# Altium project pUFM_Digital_Interface_R0.1.PrjPcb (part 1 of 2)
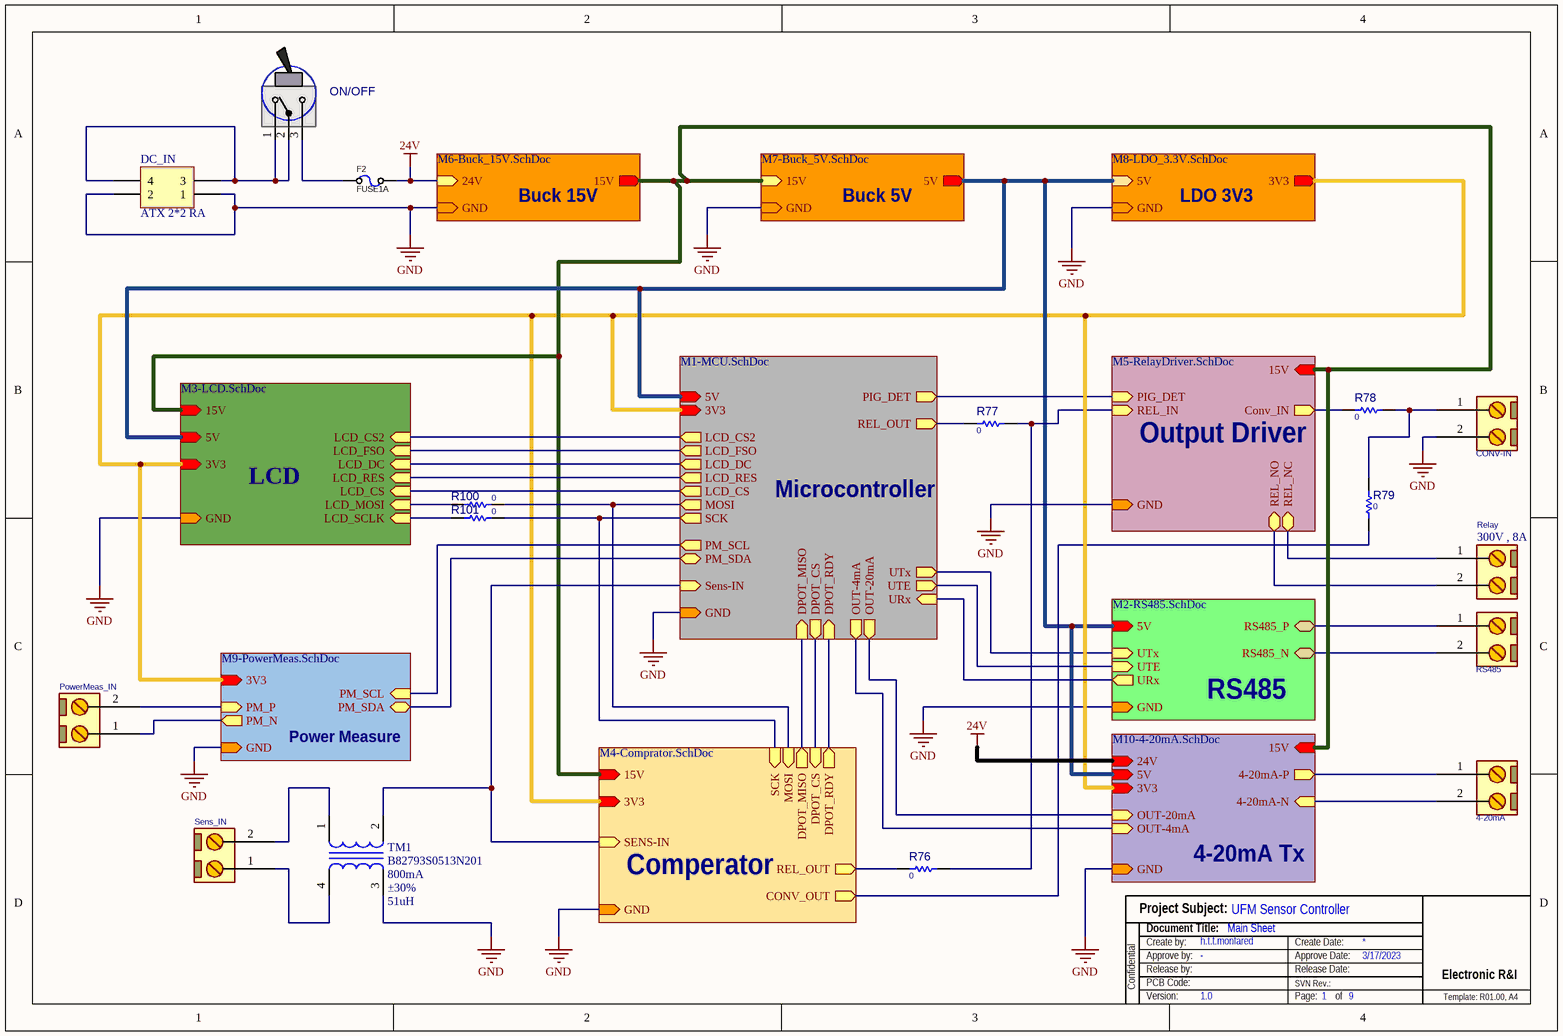
[diagram p0: MainSheet.SchDoc]
Approve Date: 3/17/2023; Approver: Approver; Business Unit: BU name; Config: Config Code; Create Date: TBD; Creator: h.t.t.monfared; Crouse Reference Code: CR Code; Customer Reference: TECH NO; Multi PCBA Code: Multi PCBA Code; PCB Code: 1.00; PCB Name: PCB Name; Product Name: Smart Water Pump Control; Product Version: PR number; Project Code: Project Code; Release Date: -; Responsible: h.t.t.monfared; Semi-finished PCBA Code: Semi-finished PCBA Code; Single PCBA Code: Single PCBA Code; Software: Software Code; Status: Status
11 sheets, 267 parts. Net scope: hierarchical (ports join the sheet entries above them; power ports are global).
Board file: pUFM_Digital_Interface_R0.1-PCB.PcbDoc
Sheets:
  MainSheet.SchDoc
    Microcontroller = M1-MCU.SchDoc
    Buck 15V = M6-Buck_15V.SchDoc
    Buck 5V = M7-Buck_5V.SchDoc
    LDO 3V3 = M8-LDO_3.3V.SchDoc
    Output Driver = M5-RelayDriver.SchDoc
    LCD = M3-LCD.SchDoc
    RS485 = M2-RS485.SchDoc
    Comperator = M4-Comprator.SchDoc
    Power Measure = M9-PowerMeas.SchDoc
    4-20mA Tx = M10-4-20mA.SchDoc

## Sheet MainSheet.SchDoc
size A4; Date: -; ApprovedBy: -; CheckedBy: h.t.t.monfared; Author: h.t.t.monfared; CompanyName: -; Engineer: h.t.t.monfared; Organization: -; Revision: 1.0; SheetNumber: 1; SheetTotal: 9; Project Code:: UFM Sensor Controller; Document Title:: Main Sheet; Material Code: 1.00; ReleasedBy: h.t.t.monfared; ImagePath: -

### Parts
4-20mA  Output  [MSTB_2]  (value not drawn)
CONV-IN  Output  [MSTB_2]  (value not drawn)
DC_IN  ATX 2*2 RA  [POWER_2X2-RA]
F2  FUSE1A  [F2410]
ON/OFF  ToggleSwitch  [SWTOG_SPDT_R_M2012]  (value not drawn)
PowerMeas_IN  (no value)  [MSTB_2]
R76  0  [R1206]
R77  0  [R1206]
R78  0  [R1206]
R79  0  [R1206]
R100  0  [R1206]
R101  0  [R1206]
Relay  300V , 8A  [MSTB_2]
RS485  Output  [MSTB_2]  (value not drawn)
Sens_IN  (no value)  [MSTB_2]
TM1  B82793S0513N201  value 51uH  Current-Rated: 800mA  Tolerance: ±30%  [Choke-7.1_6.0_4.8]

### Sub-sheets
4-20mA Tx = M10-4-20mA.SchDoc: 4-20mA-N (in), 4-20mA-P (out), 3V3 (in), GND (in), OUT-20mA (in), OUT-4mA (in), 15V (in), 24V (in), 5V (in)
Buck 5V = M7-Buck_5V.SchDoc: 15V (in), GND (in), 5V (out)
Buck 15V = M6-Buck_15V.SchDoc: 24V (in), GND (in), 15V (out)
Comperator = M4-Comprator.SchDoc: 15V (in), SENS-IN (in), GND (in), CONV_OUT (out), 3V3 (in), DPOT_CS (in), DPOT_MISO (out), DPOT_RDY (out), REL_OUT (out), SCK (in), MOSI (in)
LCD = M3-LCD.SchDoc: 3V3 (in), GND (in), LCD_MOSI (in), LCD_SCLK (in), 15V (in), 5V (in), LCD_CS (in), LCD_FSO (in), LCD_DC (in), LCD_RES (in), LCD_CS2 (in)
LDO 3V3 = M8-LDO_3.3V.SchDoc: 5V (in), GND (in), 3V3 (out)
Microcontroller = M1-MCU.SchDoc: 3V3 (in), GND (in), Sens-IN (in), UTE (out), UTx (out), URx (in), PIG_DET (out), REL_OUT (out), DPOT_CS (out), DPOT_RDY (in), PM_SDA (bidir), PM_SCL (out), 5V (in), LCD_RES (out), MOSI (out), LCD_CS2 (out), LCD_FSO (out), LCD_DC (out), LCD_CS (out), SCK (out), DPOT_MISO (in), OUT-20mA (out), OUT-4mA (out)
Output Driver = M5-RelayDriver.SchDoc: 15V (in), PIG_DET (in), GND (in), Conv_IN (out), REL_NO (bidir), REL_NC (bidir), REL_IN (in)
Power Measure = M9-PowerMeas.SchDoc: PM_SDA (bidir), 3V3 (in), GND (in), PM_P (in), PM_N (out), PM_SCL (in)
RS485 = M2-RS485.SchDoc: 5V (in), GND (in), RS485_P (bidir), RS485_N (bidir), URx (out), UTx (in), UTE (in)

### Nets
3V3: sheet Microcontroller/3V3, sheet LDO 3V3/3V3, sheet LCD/3V3, sheet Comperator/3V3, sheet Power Measure/3V3, sheet 4-20mA Tx/3V3
5V: sheet Microcontroller/5V, sheet Buck 5V/5V, sheet LDO 3V3/5V, sheet LCD/5V, sheet RS485/5V, sheet 4-20mA Tx/5V
15V: sheet Buck 15V/15V, sheet Buck 5V/15V, sheet Output Driver/15V, sheet LCD/15V, sheet Comperator/15V, sheet 4-20mA Tx/15V
24V: F2.2 ; sheet Buck 15V/24V, sheet 4-20mA Tx/24V
GND: CONV-IN.2 DC_IN.1 DC_IN.2 TM1.3 ; sheet Microcontroller/GND, sheet Buck 15V/GND, sheet Buck 5V/GND, sheet LDO 3V3/GND, sheet Output Driver/GND, sheet LCD/GND, sheet RS485/GND, sheet Comperator/GND, sheet Power Measure/GND, sheet 4-20mA Tx/GND
DPOT_CS: sheet Microcontroller/DPOT_CS, sheet Comperator/DPOT_CS
DPOT_MISO: sheet Microcontroller/DPOT_MISO, sheet Comperator/DPOT_MISO
DPOT_RDY: sheet Microcontroller/DPOT_RDY, sheet Comperator/DPOT_RDY
LCD_CS: sheet Microcontroller/LCD_CS, sheet LCD/LCD_CS
LCD_CS2: sheet Microcontroller/LCD_CS2, sheet LCD/LCD_CS2
LCD_DC: sheet Microcontroller/LCD_DC, sheet LCD/LCD_DC
LCD_FSO: sheet Microcontroller/LCD_FSO, sheet LCD/LCD_FSO
LCD_MOSI: R100.1 ; sheet LCD/LCD_MOSI
LCD_RES: sheet Microcontroller/LCD_RES, sheet LCD/LCD_RES
LCD_SCLK: R101.1 ; sheet LCD/LCD_SCLK
MOSI: R100.2 ; sheet Microcontroller/MOSI, sheet Comperator/MOSI
OUT-4mA: sheet Microcontroller/OUT-4mA, sheet 4-20mA Tx/OUT-4mA
OUT-20mA: sheet Microcontroller/OUT-20mA, sheet 4-20mA Tx/OUT-20mA
PIG_DET: sheet Microcontroller/PIG_DET, sheet Output Driver/PIG_DET
PM_SCL: sheet Microcontroller/PM_SCL, sheet Power Measure/PM_SCL
PM_SDA: sheet Microcontroller/PM_SDA, sheet Power Measure/PM_SDA
REL_OUT: R77.1 ; sheet Microcontroller/REL_OUT
SCK: R101.2 ; sheet Microcontroller/SCK, sheet Comperator/SCK
URx: sheet Microcontroller/URx, sheet RS485/URx
UTE: sheet Microcontroller/UTE, sheet RS485/UTE
UTx: sheet Microcontroller/UTx, sheet RS485/UTx
Net4-20mA_1: 4-20mA.1 ; sheet 4-20mA Tx/4-20mA-P
Net4-20mA_2: 4-20mA.2 ; sheet 4-20mA Tx/4-20mA-N
NetC43_2: RS485.2 ; sheet RS485/RS485_N
NetC44_1: RS485.1 ; sheet RS485/RS485_P
NetCONV-IN_1: CONV-IN.1 R78.2 R79.2
NetD15_2: R78.1 ; sheet Output Driver/Conv_IN
NetDC_IN_3: DC_IN.3 DC_IN.4 ON/OFF.1(T1) ON/OFF.2(COM)
NetF2_1: F2.1 ON/OFF.3(T2)
NetK1_3: Relay.1 ; sheet Output Driver/REL_NC
NetK1_4: Relay.2 ; sheet Output Driver/REL_NO
NetPowerMeas_IN_1: PowerMeas_IN.1 ; sheet Power Measure/PM_N
NetPowerMeas_IN_2: PowerMeas_IN.2 ; sheet Power Measure/PM_P
NetR9_1: TM1.2 ; sheet Microcontroller/Sens-IN, sheet Comperator/SENS-IN
NetR41_1: R76.2 R77.2 ; sheet Output Driver/REL_IN
NetR69_2: R79.1 ; sheet Comperator/CONV_OUT
NetR70_1: R76.1 ; sheet Comperator/REL_OUT
NetSens_IN_1: Sens_IN.1 TM1.4
NetSens_IN_2: Sens_IN.2 TM1.1

### Notes on the sheet
- Project Subject:
- Confidential
- Release by:
- Document Title:
- Create by:
- PCB Code:
- Approve by:
- SVN Rev.:
- Create Date:
- Release Date:
- Approve Date:
- Electronic R&I
- Version:
- Page:
- of
- Template: R01.00, A4

### Library data of the parts
4-20mA CONV-IN PowerMeas_IN Relay RS485 Sens_IN = CONN_MSTB_2: CONN, PHOENIX MSTB, 5-G, 5.08mm pitch; PARAM2: 320V; PARAM: 12A
  4-20mA CONV-IN RS485: VALUE: Output
  Relay: VALUE: 300V , 8A
DC_IN = Header 2X2: Header, 2-Pin, Dual row; LatestRevisionDate: 17-Jul-2002; LatestRevisionNote: Re-released for DXP Platform.; Publisher: Altium Limited
F2 = FUSE_1A_2410: Fuse, 1A, 125VDC, 2410, SMD, Fast Acting; PARAM: 1A; 125VDC; fast acting; MANF: Reomax; MANF_P#: SFE1100; PARAM2: 0.25 Ohm DC Cold Resistance; PRICE: 260toman@Javan; VALUE: FUSE1A
ON/OFF = SWTOG_SPDT_R_M2012: SWITCH, TOGGLE, SPDT, THD; MANF_PART#: M2012SA2W30; MANF: NKK; PARAM: 3A, 125VAC/30VDC; DESC: DESCRIPTION; VALUE: ToggleSwitch; ASSEMBLY: ASSEMBLY; PRICE: 3.5$
R76-R79 R100 R101 = RES_SMD: RESISTOR, SMD; PARAM: -W; DESC: DESCRIPTION; DIST#: MOUSER; PARAM2: 1%; MANF_P#: -; MANF: -; ASSEMBLY: ASSEMBLY; PRICE: 100= 0.5$; VALUE: 0
TM1 = ME90902601: Inductor,S,Choke,Ferrite,800mA,30%,7.1x6x4.8mm; Manufacturer Code1: 0000101476; Manufacturer Name1: TDK Europe GmbH; Unit Price (USD): Coming Soon; Alternative: Please Add; Description Farsi: سلف،S،Choke،800mA،30%،7.1x6x4.8mm; Resistance-DC (Rdc): 0.14(Ohm); Automotive Qualified: AEC-Q200; Frequency-Test-Q: NA; Packing: TAPE AND REEL; Frequency-Test-L: 100KHz; Voltage-Rated: 80V; Material: ME90902601; Function in Circuit: Please Add; Material Class: Inductor; Type: Choke; Lead Free: YES; Frequency-Self Resonant (SRF): NA; ComponentLink1URL: \\192.168.5.63\eRI_ComponentDatabase\Datasheets\SAP\DSH_2025891_00_1.PDF; Termination Style (SMD/THT): SMD; Manufacturer PN1: B82793S0513N201; Quality Factor (Q): NA; ComponentLink1Description: DSH2025891RE: Datasheet-TDK; RoHS: YES; Size (LxWxH)/(DxH): L7.1xW6xH4.8mm

## Sheet M1-MCU.SchDoc
size A3; ApprovedBy: -; CheckedBy: h.t.t.monfared; Author: h.t.t.monfared; Engineer: h.t.t.monfared; Revision: 1.0; SheetNumber: 2; SheetTotal: 9; Project Code:: UFM Sensor Controller; Document Title:: MCU Sheet; Material Code: 1.00; ReleasedBy: h.t.t.monfared
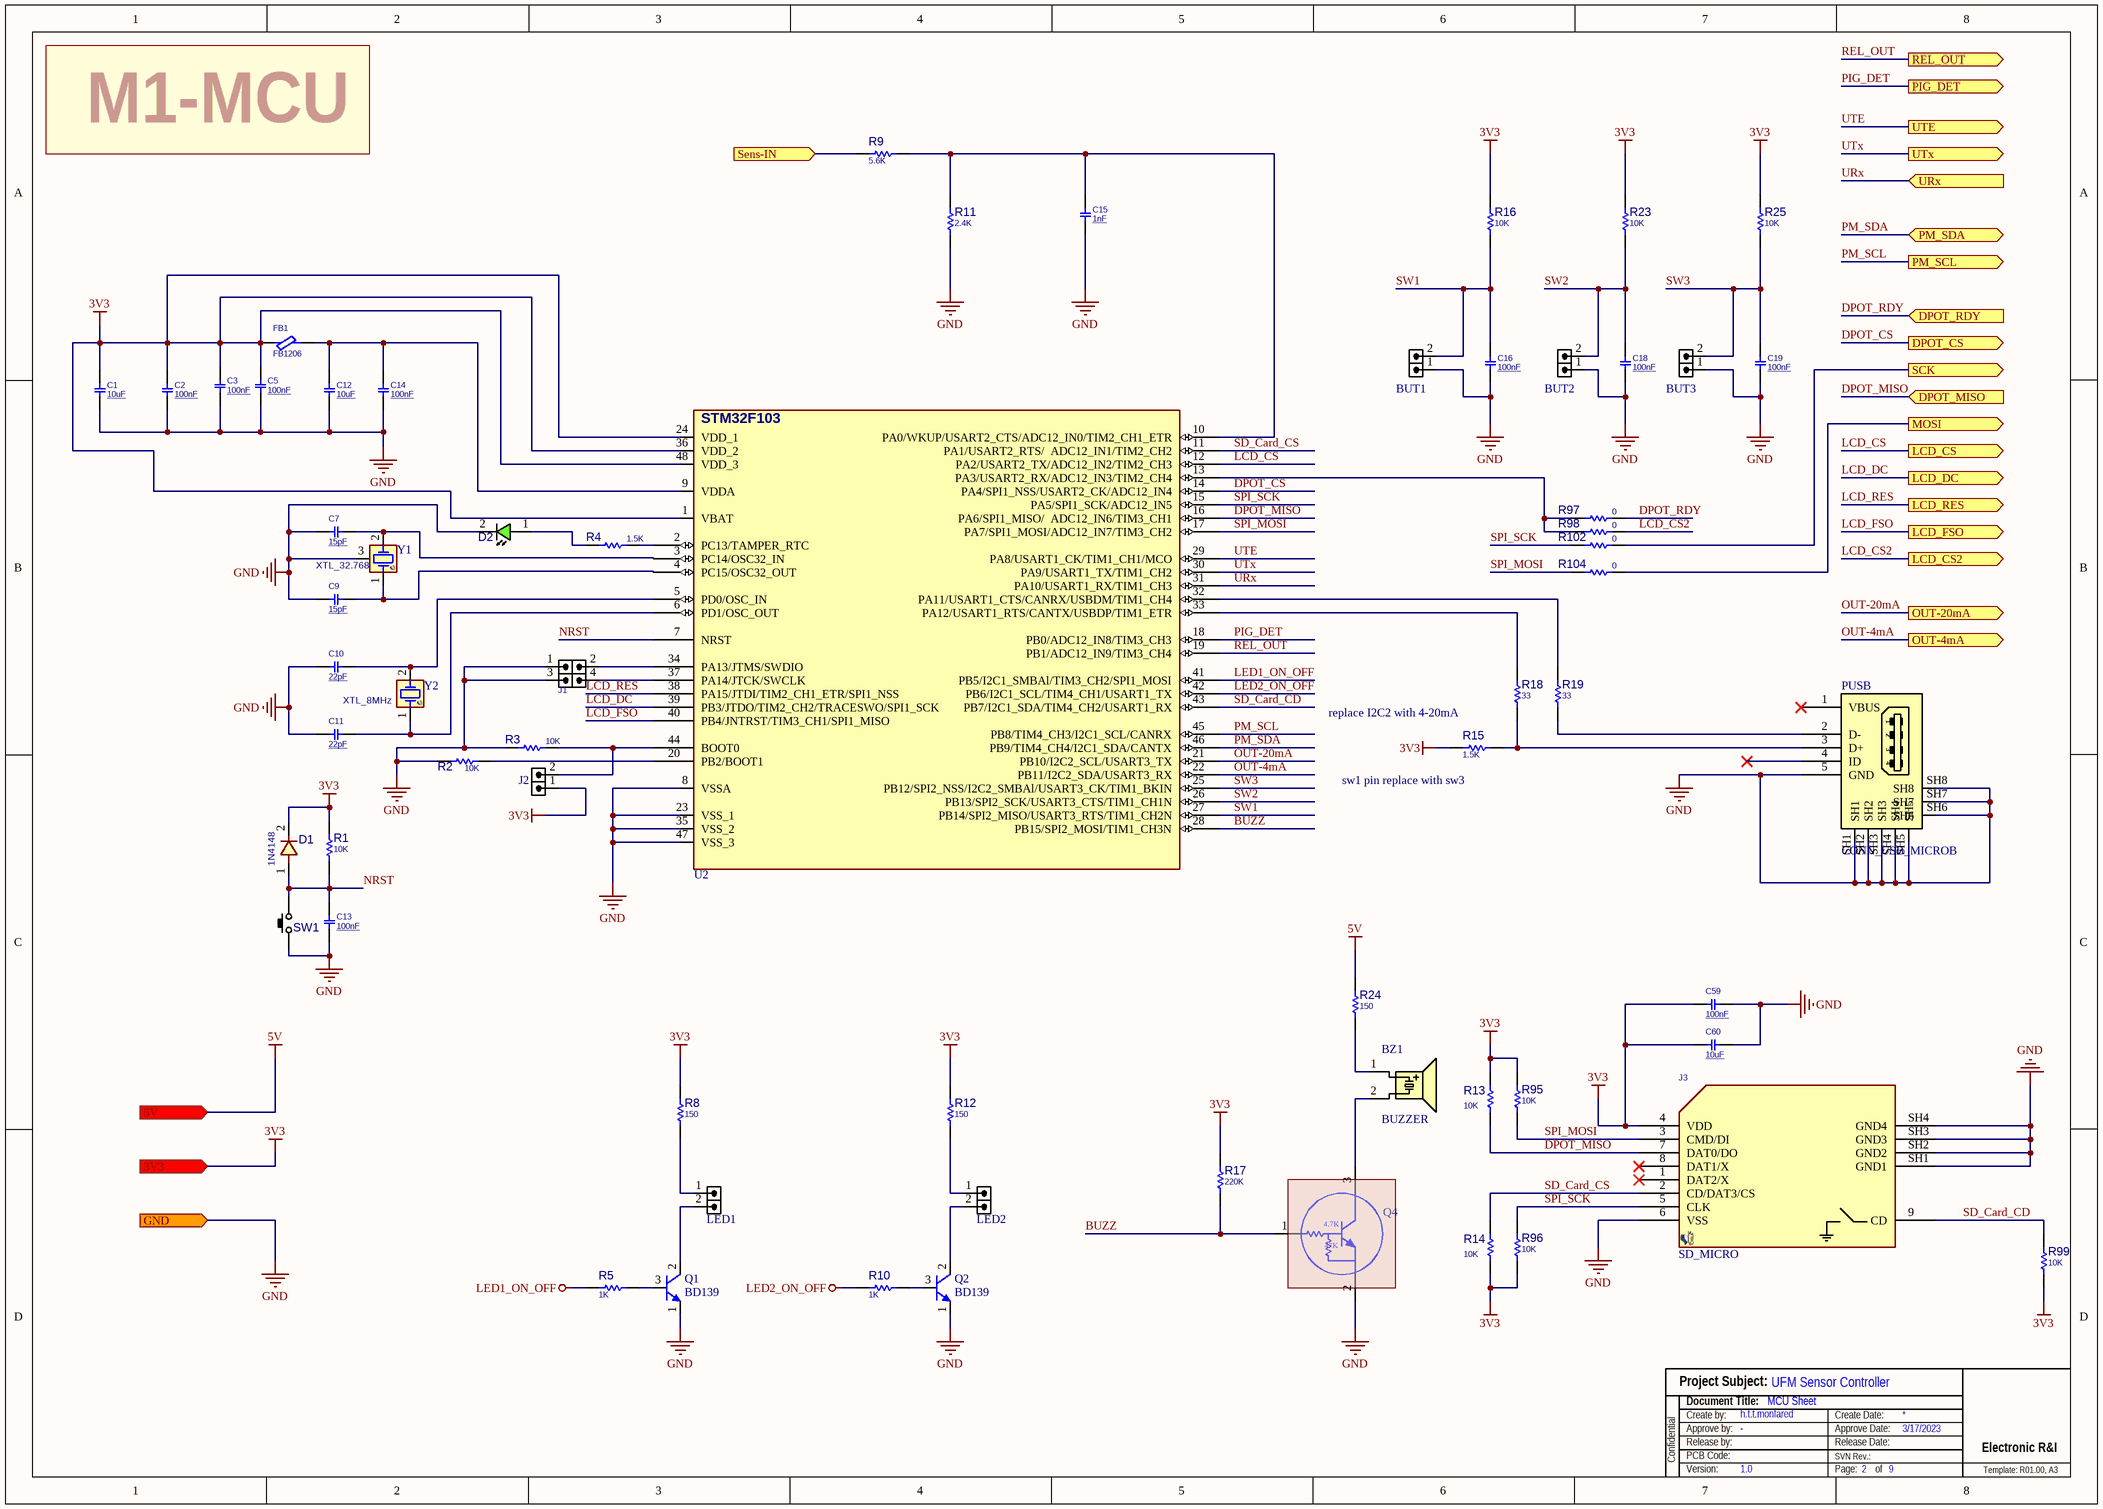
[diagram p1: M1-MCU.SchDoc]

### Parts
BUT1  HDRM2  [TMS2]  (value not drawn)
BUT2  HDRM2  [TMS2]  (value not drawn)
BUT3  HDRM2  [TMS2]  (value not drawn)
BZ1  BUZZER  [BZ_C12]
C1  10uF  [C1206]
C2  100nF  [C1206]
C3  100nF  [C1206]
C5  100nF  [C1206]
C7  15pF  [C1206]
C9  15pF  [C1206]
C10  22pF  [C1206]
C11  22pF  [C1206]
C12  10uF  [C1206]
C13  100nF  [C1206]
C14  100nF  [C1206]
C15  1nF  [C1206]
C16  100nF  [C1206]
C18  100nF  [C1206]
C19  100nF  [C1206]
C59  100nF  [C1206]
C60  10uF  [C1206]
D1  1N4148  [D_AX02_DO35]
D2  LED1206GRN  [LED1206GRN]  (value not drawn)
FB1  FB1206  [L1206]
J1  HDRM_2X2  [HDR_M_2X2]  (value not drawn)
J2  HDRM2  [HDR_M_1X2]  (value not drawn)
J3  SD_MICRO  [SDMICRO_AT]
LED1  HDRM2  [TMS2]  (value not drawn)
LED2  HDRM2  [TMS2]  (value not drawn)
PUSB  CONN_USB_MICROB  [USB_MICRO_B_BM_SHS]
Q1  BD139  [TO126_3]
Q2  BD139  [TO126_3]
Q4  BCR116  [SOT23]  (value not drawn)
R1  10K  [R1206]
R2  10K  [R1206]
R3  10K  [R1206]
R4  1.5K  [R1206]
R5  1K  [R1206]
R8  150  [R1206]
R9  5.6K  [R1206]
R10  1K  [R1206]
R11  2.4K  [R1206]
R12  150  [R1206]
R13  10K  [R1206]
R14  10K  [R1206]
R15  1.5K  [R1206]
R16  10K  [R1206]
R17  220K  [R1206]
R18  33  [R1206]
R19  33  [R1206]
R23  10K  [R1206]
R24  150  [R1206]
R25  10K  [R1206]
R95  10K  [R1206]
R96  10K  [R1206]
R97  0  [R1206]
R98  0  [R1206]
R99  10K  [R1206]
R102  0  [R1206]
R104  0  [R1206]
SW1  PUSHBUTTON  [SWPBS_SPST_6X3X5]  (value not drawn)
U2  STM32F103  [QFG50_48]  (value not drawn)
Y1  XTL_32.768  [XTLT_RTC]
Y2  XTL_8MHz  [XTL_2_11X5]

### Ports
3V3 (in), 5V (in), DPOT_CS (out), DPOT_MISO (in), DPOT_RDY (in), GND (in), LCD_CS2 (out), LCD_CS (out), LCD_DC (out), LCD_FSO (out), LCD_RES (out), MOSI (out), OUT-4mA (out), OUT-20mA (out), PIG_DET (out), PM_SCL (out), PM_SDA (bidir), REL_OUT (out), SCK (out), Sens-IN (in), URx (in), UTE (out), UTx (out)

### Nets
3V3: C1.2 C2.2 C3.2 C5.2 C59.1 C60.1 D1.2 FB1.1 J2.1 J3.4(VDD) R1.2 R8.2 R12.2 R13.2 R14.1 R15.1 R16.2 R17.2 R23.2 R25.2 R95.2 R96.1 R99.1 U2.1(VBAT) U2.24(VDD_1) U2.36(VDD_2) U2.48(VDD_3) ; port 3V3
5V: R24.2 ; port 5V
GND: BUT1.1 BUT2.1 BUT3.1 C1.1 C2.1 C3.1 C5.1 C7.1 C9.1 C10.1 C11.1 C12.2 C13.1 C14.1 C15.1 C16.1 C18.1 C19.1 C59.2 C60.2 D2.2(CATHODE) J1.1 J1.3 J3.6(VSS) J3.SH1(GND1) J3.SH2(GND2) J3.SH3(GND3) J3.SH4(GND4) PUSB.5(GND) PUSB.SH1 PUSB.SH2 PUSB.SH3 PUSB.SH4 PUSB.SH5 PUSB.SH6 PUSB.SH7 PUSB.SH8 Q1.1(E) Q2.1(E) Q4.2(E) R2.1 R3.1 R11.1 SW1.1(P1) U2.8(VSSA) U2.23(VSS_1) U2.35(VSS_2) U2.47(VSS_3) Y1.3(CASE) ; port GND
LED1_ON_OFF: R5.1 U2.41(PB5/I2C1_SMBAl/TIM3_CH2/SPI1_MOSI)
LED2_ON_OFF: R10.1 U2.42(PB6/I2C1_SCL/TIM4_CH1/USART1_TX)
BUZZ: Q4.1(B) R17.1 U2.28(PB15/SPI2_MOSI/TIM1_CH3N)
DPOT_CS: U2.14(PA4/SPI1_NSS/USART2_CK/ADC12_IN4) ; port DPOT_CS
DPOT_MISO: J3.7(DAT0/DO) R13.1 U2.16(PA6/SPI1_MISO/__ADC12_IN6/TIM3_CH1) ; port DPOT_MISO
DPOT_RDY: R97.2 ; port DPOT_RDY
LCD_CS: U2.12(PA2/USART2_TX/ADC12_IN2/TIM2_CH3) ; port LCD_CS
LCD_CS2: R98.2 ; port LCD_CS2
LCD_DC: U2.39(PB3/JTDO/TIM2_CH2/TRACESWO/SPI1_SCK) ; port LCD_DC
LCD_FSO: U2.40(PB4/JNTRST/TIM3_CH1/SPI1_MISO) ; port LCD_FSO
LCD_RES: U2.38(PA15/JTDI/TIM2_CH1_ETR/SPI1_NSS) ; port LCD_RES
MOSI: R104.2 ; port MOSI
NRST: C13.2 D1.1 R1.1 SW1.2(P3) U2.7(NRST)
OUT-4mA: U2.22(PB11/I2C2_SDA/USART3_RX) ; port OUT-4mA
OUT-20mA: U2.21(PB10/I2C2_SCL/USART3_TX) ; port OUT-20mA
PIG_DET: U2.18(PB0/ADC12_IN8/TIM3_CH3) ; port PIG_DET
PM_SCL: U2.45(PB8/TIM4_CH3/I2C1_SCL/CANRX) ; port PM_SCL
PM_SDA: U2.46(PB9/TIM4_CH4/I2C1_SDA/CANTX) ; port PM_SDA
REL_OUT: U2.19(PB1/ADC12_IN9/TIM3_CH4) ; port REL_OUT
SCK: R102.2 ; port SCK
SD_Card_CD: J3.9(CD) R99.2 U2.43(PB7/I2C1_SDA/TIM4_CH2/USART1_RX)
SD_Card_CS: J3.2(CD/DAT3/CS) R14.2 U2.11(PA1/USART2_RTS/__ADC12_IN1/TIM2_CH2)
SPI_MOSI: J3.3(CMD/DI) R95.1 R104.1 U2.17(PA7/SPI1_MOSI/ADC12_IN7/TIM3_CH2)
SPI_SCK: J3.5(CLK) R96.2 R102.1 U2.15(PA5/SPI1_SCK/ADC12_IN5)
SW1: BUT1.2 C16.2 R16.1 U2.27(PB14/SPI2_MISO/USART3_RTS/TIM1_CH2N)
SW2: BUT2.2 C18.2 R23.1 U2.26(PB13/SPI2_SCK/USART3_CTS/TIM1_CH1N)
SW3: BUT3.2 C19.2 R25.1 U2.25(PB12/SPI2_NSS/I2C2_SMBAl/USART3_CK/TIM1_BKIN)
URx: U2.31(PA10/USART1_RX/TIM1_CH3) ; port URx
UTE: U2.29(PA8/USART1_CK/TIM1_CH1/MCO) ; port UTE
UTx: U2.30(PA9/USART1_TX/TIM1_CH2) ; port UTx
NetBZ1_1: BZ1.1(A) R24.1
NetBZ1_2: BZ1.2(B) Q4.3(C)
NetC7_2: C7.2 U2.3(PC14/OSC32_IN) Y1.2(OSC2)
NetC9_2: C9.2 U2.4(PC15/OSC32_OUT) Y1.1(OSC1)
NetC10_2: C10.2 U2.5(PD0/OSC_IN) Y2.2(OSC2)
NetC11_2: C11.2 U2.6(PD1/OSC_OUT) Y2.1(OSC1)
NetC12_1: C12.1 C14.2 FB1.2 U2.9(VDDA)
NetC15_2: C15.2 R9.2 R11.2 U2.10(PA0/WKUP/USART2_CTS/ADC12_IN0/TIM2_CH1_ETR)
NetD2_1: D2.1(ANODE) R4.1
NetJ1_2: J1.2 U2.34(PA13/JTMS/SWDIO)
NetJ1_4: J1.4 U2.37(PA14/JTCK/SWCLK)
NetJ2_2: J2.2 R3.2 U2.44(BOOT0)
NetLED1_1: LED1.1 R8.1
NetLED1_2: LED1.2 Q1.2(C)
NetLED2_1: LED2.1 R12.1
NetLED2_2: LED2.2 Q2.2(C)
NetPUSB_2: PUSB.2(D-) R19.1
NetPUSB_3: PUSB.3(D+) R15.2 R18.1
NetQ1_3: Q1.3(B) R5.2
NetQ2_3: Q2.3(B) R10.2
NetR2_2: R2.2 U2.20(PB2/BOOT1)
NetR4_2: R4.2 U2.2(PC13/TAMPER_RTC)
NetR9_1: R9.1 ; port Sens-IN
NetR18_2: R18.2 U2.33(PA12/USART1_RTS/CANTX/USBDP/TIM1_ETR)
NetR19_2: R19.2 U2.32(PA11/USART1_CTS/CANRX/USBDM/TIM1_CH4)
NetR97_1: R97.1 R98.1 U2.13(PA3/USART2_RX/ADC12_IN3/TIM2_CH4)

Not connected (* = marked no-connect by the designer): J3 1(DAT2/X)* 8(DAT1/X)*; PUSB 1(VBUS)* 4(ID)*

### Notes on the sheet
- M1-MCU
- replace I2C2 with 4-20mA
- (near R15) sw1 pin replace with sw3
- Project Subject:
- Confidential
- Release by:
- Document Title:
- Create by:
- PCB Code:
- Approve by:
- SVN Rev.:
- Create Date:
- Release Date:
- Approve Date:
- Electronic R&I
- Version:
- Page:
- of
- Template: R01.00, A3
- (in symbol BCR116) 4.7K; 47K

### Library data of the parts
BUT1-BUT3 J2 LED1 LED2 = HDR_M_1X2: CONN, HEADER, Male, pitch: 2.54mm, 2POS; VALUE: HDRM2
BZ1 = BUZZER_C12: Buzzer, 12X8.5mm, Magnetic Transducer; MANF: Buerklin, CUI; MANF_P#: CM12P, MT03-H1BHP, BMT1205XH7.5, CEM-1201(50); PARAM2: 3~7VCC; PARAM: 2048 ±200 Hz; PRICE: PRICE; VALUE: BUZZER
C1-C3 C5 C7 C9-C16 C18 C19 C59 C60 = CAP_SMD_MLCC: CAP, MLCC, 1nF, 50V, C0G, 10%, 0402; MANF_P#: MANF_PART#; MANF: Murata; PRICE: 100= 1$; DESC: CAP, MLCC, 1nF, 50V, C0G, 10%, 0402; ASSEMBLY: ASSEMBLY
  C1 C12 C60: PARAM: C0G, 10%; PARAM2: 50V; VALUE: 10uF
  C2 C3 C5 C13 C14: PARAM: 50V; PARAM2: C0G, 10%; VALUE: 100nF
  C7 C9: PARAM: 50V; PARAM2: C0G, 10%; VALUE: 15pF
  C10 C11: PARAM: 50V; PARAM2: C0G, 10%; VALUE: 22pF
  C15: PARAM: C0G, 10%; PARAM2: 50V; VALUE: 1nF
  C16 C18 C19 C59: PARAM: C0G, 10%; PARAM2: 50V; VALUE: 100nF
D1 = DIODE_THD_1N4148_DO35: DIODE, FAST SWTICHING, THD; DESC: DESCRIPTION; PARAM: 75V; PARAM2: 0.3A; MANF: MANF; ASSEMBLY: ASSEMBLY; PRICE: PRICE; MANF_P#: 1N4148; VALUE: 1N4148
D2 = LED_SMD_1206_GRN: LED, SMD, 1206, GREEN; PARAM: 20mA; DESC: DESCRIPTION; PARAM2: 2.2V; MANF: -; ASSEMBLY: ASSEMBLY; PRICE: 36t@Javan; MANF_P#: -; VALUE: LED1206GRN
FB1 = FBEAD_SMD_BLM31PG330: FERRITE_Bead, 1206, 6A, 9mOhm, 33@100MHz; MANF: Murata; MANF_P#: BLM31PG330SN1L; PARAM: 33@100MHz; PARAM2: 6A, 9mOhm; VALUE: FB1206
J1 = HDR_M_2X2: CONN, HEADER, Male, pitch: 2.54mm, 4POS; MANF_P#: MANF_PART#; MANF: MANF; VALUE: HDRM_2X2
J3 = SOCKET_SDMICRO_AT: SD MICRO exist in Iran, Attend 112J-TDAR-R01; PARAM: push-push; MANF: Attend; MANF_P#: 112J-TDAR-R01; VALUE: SD_MICRO
PUSB = CONN_USB_MICRO_B_BM_SHS: CONN, USB, MICRO B, R/A, SMD, BOTTOM MOUNT; MANF_P#: 47346-0001; MANF: Molex; MANF_P#2: HIROSE ZX62-AB-5PA; PARAM2: 30VAC; PARAM: 1.8A, -20~85oC; PRICE: 0.75$; VALUE: CONN_USB_MICROB
Q1 Q2 = NPN_BD139_TO126: BJT, NPN, 80V, 1.5A; MANF: FAIRCHILD; VALUE: BD139; MANF_P#: BD139
Q4 = BCR116: NPN Silicon Digital Transistor
R1-R4 R8 R12 R15 R18 R19 = RES_SMD: RESISTOR, SMD; MANF_P#: RK73H1ETTP4701F; MANF: KOA SPEER; PARAM: 0.063W; DESC: DESCRIPTION; DIST#: MOUSER; PARAM2: 1%; ASSEMBLY: ASSEMBLY; PRICE: 100= 0.5$
  R1-R3: VALUE: 10K
  R4 R15: VALUE: 1.5K
  R8 R12: VALUE: 150
  R18 R19: VALUE: 33
R5 R10 = RES_SMD: RESISTOR, SMD; MANF_P#: RK73H1ETTP4701F; MANF: KOA SPEER; PARAM: 0.063W; DESC: DESCRIPTION; DIST#: MOUSER; PARAM2: 10%; ASSEMBLY: ASSEMBLY; PRICE: 100= 0.5$; VALUE: 1K
R9 R11 R13 R14 R16 R17 R23-R25 R95-R99 R102 R104 = RES_SMD: as R76 on sheet MainSheet; MANF_P#: -; MANF: -; ASSEMBLY: ASSEMBLY; PRICE: 100= 0.5$
  R9: VALUE: 5.6K
  R11: VALUE: 2.4K
  R13 R14 R16 R23 R25 R95 R96 R99: VALUE: 10K
  R17: VALUE: 220K
  R24: VALUE: 150
  R97 R98 R102 R104: VALUE: 0
SW1 = SWPBS_SPST_6X3X4: SWITCH, PUSH BUTTON, TACTILE, SMD, SPST, 6X3.5X4.3mm; MANF: Panasonic; DESC: DESCRIPTION; MANF_P#: EVQ-PNF04M; VALUE: PUSHBUTTON; ASSEMBLY: ASSEMBLY; PARAM: PARAM; PRICE: PRICE
U2 = STM32F103C8T6_QFP48: MCU, STM32 ARM 32-bit, Cortex M3, 64KB FLASH, 20KB SRAM; DESC: CAN, I2C, SPI, USART, USB; MANF: ST; PARAM2: 2~3.6VCC, 72MHz, 2X12Bit ADC; PARAM: 64KB FLASH, 20KB SRAM, -40~85oC; MANF_P#: STM32F103C8T6; PRICE: 6$; VALUE: STM32F103
Y1 = XTL_3_32.768_THD: Crystal MOST POPULAR PACKAGE; MANF: ABRACON; MANF_P#: AB26T-32.768KHZ; PARAM2: 12pF; PARAM: 20PPM, -40~85°C; VALUE: XTL_32.768
Y2 = XTL_2_HC49_8MHz_SMD: Crystal MOST POPULAR ABL HC49 PACKAGE; MANF: ABRACON; MANF_P#: ABLS-8.000MHZ-B4-T; PARAM: 8MHz, 18pF, 30PPM, -20~70oC; PRICE: 0.3$; VALUE: XTL_8MHz

## Sheet M6-Buck_15V.SchDoc
size A4; ApprovedBy: -; CheckedBy: h.t.t.monfared; Author: h.t.t.monfared; Engineer: h.t.t.monfared; Revision: 1.00; SheetNumber: 6; SheetTotal: 10; Project Code:: UFM Sensor Controller; Document Title:: SMPS Buck 15V; Material Code: 1.00; ReleasedBy: h.t.t.monfared
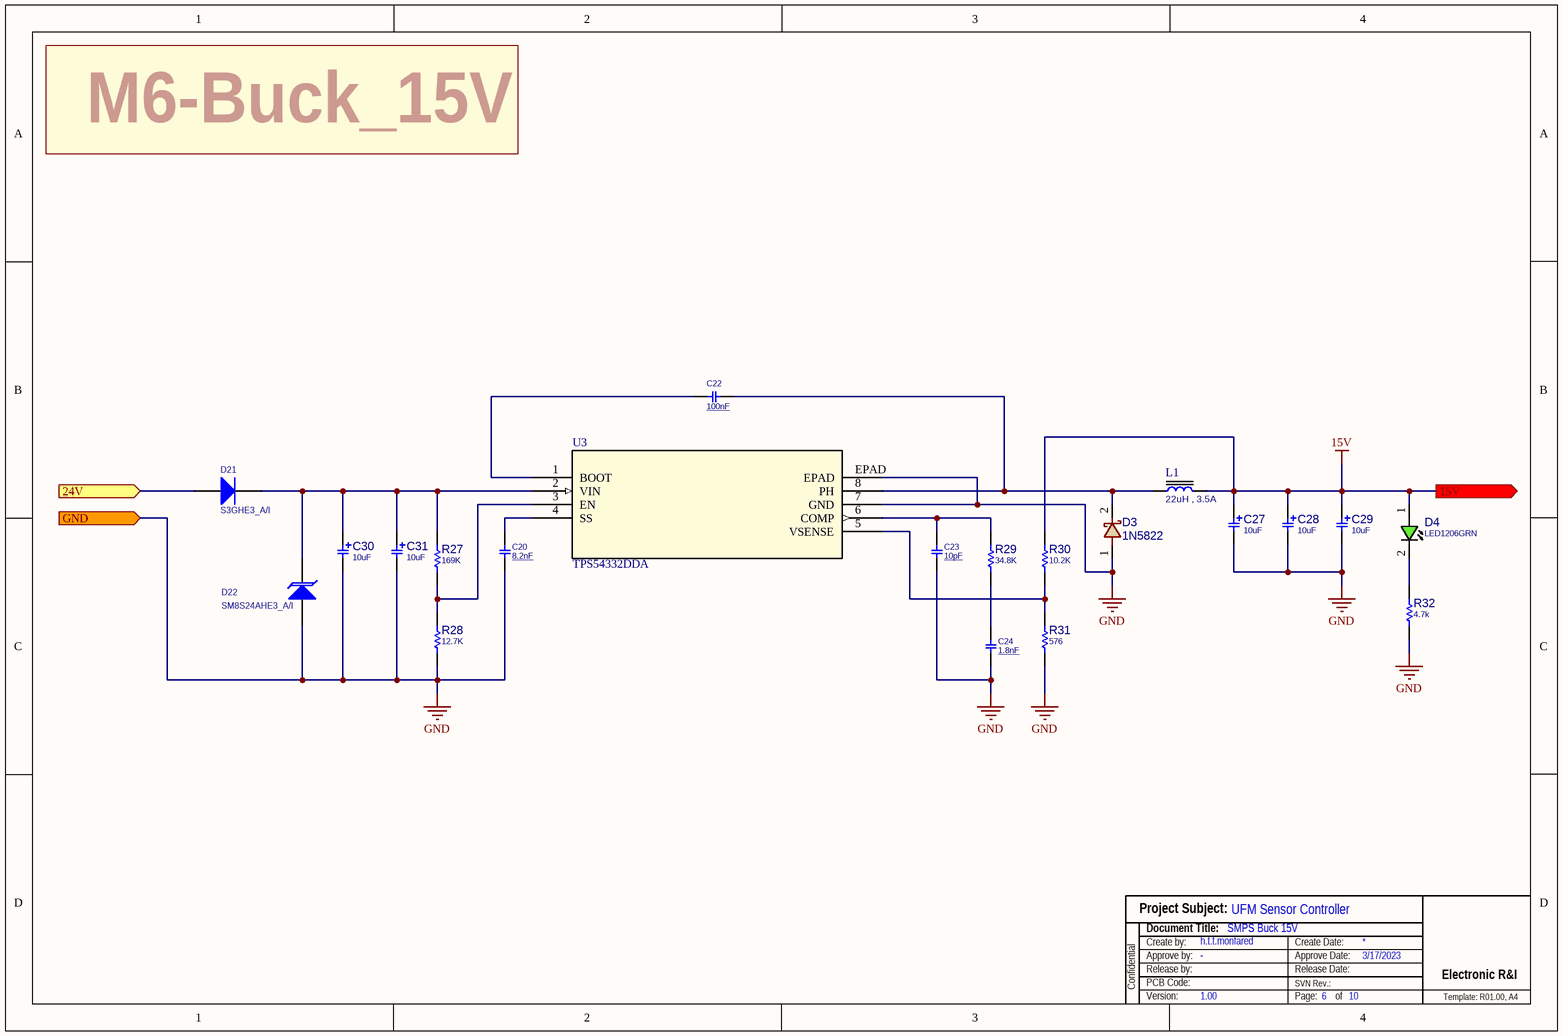
[diagram p2: M6-Buck_15V.SchDoc]

### Parts
C20  8.2nF  [C1206]
C22  100nF  [C1206]
C23  10pF  [C1206]
C24  1.8nF  [C1206]
C27  10uF  [C1206]
C28  10uF  [C1206]
C29  10uF  [C1206]
C30  10uF  [C1206]
C31  10uF  [C1206]
D3  1N5822  [D_AX06_DO27]
D4  LED1206GRN  [LED1206GRN]
D21  S3GHE3_A/I  [DO214AB (SMC)]
D22  SM8S24AHE3_A/I  [DO-218AB]
L1  22uH , 3.5A  [L_12]
R27  169K  [R1206]
R28  12.7K  [R1206]
R29  34.8K  [R1206]
R30  10.2K  [R1206]
R31  576  [R1206]
R32  4.7k  [R1206]
U3  TPS54332DDA  [SO_8T]

### Ports
15V (out), 24V (in), GND (in)

### Nets
15V: C27.1 C28.1 C29.1 D4.1(ANODE) L1.2 R30.2 ; port 15V
24V: D21.1(A) ; port 24V
GND: C20.1 C23.1 C24.1 C27.2 C28.2 C29.2 C30.2 C31.2 D3.1(A) D22.1(A) R28.1 R31.1 R32.1 U3.7(GND) U3.EPAD ; port GND
NetC20_2: C20.2 U3.4(SS)
NetC22_1: C22.1 U3.1(BOOT)
NetC22_2: C22.2 D3.2(K) L1.1 U3.8(PH)
NetC23_2: C23.2 R29.2 U3.6(COMP)
NetC24_2: C24.2 R29.1
NetC30_1: C30.1 C31.1 D21.2(K) D22.2(K) R27.2 U3.2(VIN)
NetD4_2: D4.2(CATHODE) R32.2
NetR27_1: R27.1 R28.2 U3.3(EN)
NetR30_1: R30.1 R31.2 U3.5(VSENSE)

### Notes on the sheet
- M6-Buck_15V
- Project Subject:
- Confidential
- Release by:
- Document Title:
- Create by:
- PCB Code:
- Approve by:
- SVN Rev.:
- Create Date:
- Release Date:
- Approve Date:
- Electronic R&I
- Version:
- Page:
- of
- Template: R01.00, A4

### Library data of the parts
C20 C22-C24 = CAP_SMD_MLCC: as C1 on sheet M1-MCU; PARAM: 50V; PRICE: 100= 1$; DESC: CAP, MLCC, 1nF, 50V, C0G, 10%, 0402; PARAM2: C0G, 10%; ASSEMBLY: ASSEMBLY
  C20: VALUE: 8.2nF
  C22: VALUE: 100nF
  C23: VALUE: 10pF
  C24: VALUE: 1.8nF
C27-C31 = CAP_SMD_EL: CAP, THD, ELEC,; MANF_P#: MANF_PART#; PARAM2: 20%; DESC: DESCRIPTION; DIST#: MOUSER; PARAM: 25V; PRICE: 10= 5$; MANF: MANF; ASSEMBLY: ASSEMBLY; VALUE: 10uF
D3 = DIODE_THD_SCHOTTKY_1N5822: DIODE, SCHOTTKY, 40V, 3A; MANF: Diodes; DESC: DESCRIPTION; MANF_P#: 1N5822; ASSEMBLY: ASSEMBLY; PRICE: PRICE; PARAM2: 3A; PARAM: 40V; VALUE: 1N5822
D4 = LED_SMD_1206_GRN: as D2 on sheet M1-MCU; MANF: -; ASSEMBLY: ASSEMBLY; PRICE: 36t@Javan; MANF_P#: -; VALUE: LED1206GRN
D21 = ME04056001: Diode-Rectifier,S,Single,400V,3A,SMC; Manufacturer Code1: 0000101437; Manufacturer Name1: Vishay; Unit Price (USD): Coming Soon; Alternative: Please Add; Description Farsi: SMC,400V,3A,Single,S,دیود یکسوساز; AltCode-1: ALTE433:ACTIVE; AltMat-1: ME04050201; Automotive Qualified: AEC-Q101; Current-Max Reverse Leakage: 10uA; Current-NonrepetitivePeakSurge: 100A; Number of Unit: 1; Packing: TAPE AND REEL; Temperature-Max Operation: 150°C; Temperature-Min Operation: -55°C; Time-Reverse Recovery: 2.5us; Voltage-Max Forward: 1.15V; Material: ME04056001; Function in Circuit: Please Add; Material Class: Diode-Rectifier; ComponentLink1Description: DSH2027395RE: Datasheet-VISHAY; ComponentLink1URL: \\192.168.5.63\eRI_ComponentDatabase\Datasheets\SAP\DSH_2027395_00_1.PDF; ComponentLink2Description: DSH2066440RE: TDT_Infineon; ComponentLink2URL: \\192.168.5.63\eRI_ComponentDatabase\Datasheets\SAP\DSH_2066440_00_1.PDF; Current-Max Forward: 3A; Lead Free: YES; Manufacturer PN1: S3GHE3_A/I; Package/Case: SMC(DO-214AB); RoHS: YES; Temperature-Max Storage: 150°C; Temperature-Min Storage: -55°C; Termination Style (SMD/THT): SMD; Voltage-RepetitivePeakReverse: 400V
D22 = ME04196201: TVS,S,UNI,26.7V,6600W,DO218AB; Manufacturer Name1: Vishay; Manufacturer Code1: 0000101437; Automotive Qualified: AEC-Q101; Packing: TAPE AND REEL; Description Farsi: S,UNI,26.7V,6600W,DO218AB,ديود محافظ; ESD-HBM: Not Mentioned; Current-Max Reverse Leakage: 10uA; Current-Peak Pulse: 170A; Temperature-Max Operation: 175°C; Temperature-Min Operation: -55°C; Type: Unidirectional; Voltage-Clamping: 38.9V; Voltage-Standoff: 24V; Unit Price (USD): Coming Soon; Function in Circuit: Please Add; Material: ME04196201; ComponentLink1URL: \\192.168.5.63\eRI_ComponentDatabase\Datasheets\SAP\DSH_2075710_00_1.PDF; ComponentLink1Description: DSH2075710RE: DSH-PKG_VISHAY; Halogen Free: NA; Lead Free: NA; Manufacturer PN1: SM8S24AHE3_A/I; Package/Case: DO-218AB; RoHS: YES; Termination Style (SMD/THT): SMD; ESD-MM: Not Mentioned; ESD-STD: NOT MENTIONED; Power: 6600W; Voltage-Breakdown: 26.7V; ComponentLink2Description: DSH2079777RE: TDT_ST; ComponentLink2URL: \\192.168.5.63\eRI_ComponentDatabase\Datasheets\SAP\DSH_2079777_00_1.PDF; ComponentLink3Description: DSH2079518RE: TDT_Vishay; ComponentLink3URL: \\192.168.5.63\eRI_ComponentDatabase\Datasheets\SAP\DSH_2079518_00_1.PDF; Alternative: Please Add; Material Class: TVS
L1 = IND_THD: INDUCTOR, THD; VALUE: 22uH , 3.5A
R27-R32 = RES_SMD: as R1 on sheet M1-MCU; ASSEMBLY: ASSEMBLY; PRICE: 100= 0.5$
  R27: VALUE: 169K
  R28: VALUE: 12.7K
  R29: VALUE: 34.8K
  R30: VALUE: 10.2K
  R31: VALUE: 576
  R32: VALUE: 4.7k
U3 = TPS54332DDA: No Description Available; Mfr_Name: Texas Instruments; Copyright: Copyright (C) 2022 Ultra Librarian. All rights reserved.; Manufacturer_Part_Number: TPS54332DDA; RefDes: RefDes; Type: Type

## Sheet M7-Buck_5V.SchDoc
size A4; ApprovedBy: -; CheckedBy: h.t.t.monfared; Author: h.t.t.monfared; Engineer: h.t.t.monfared; Revision: 1.00; SheetNumber: 7; SheetTotal: 10; Project Code:: UFM Sensor Controller; Document Title:: SMPS Buck 5V; Material Code: 1.00; ReleasedBy: h.t.t.monfared
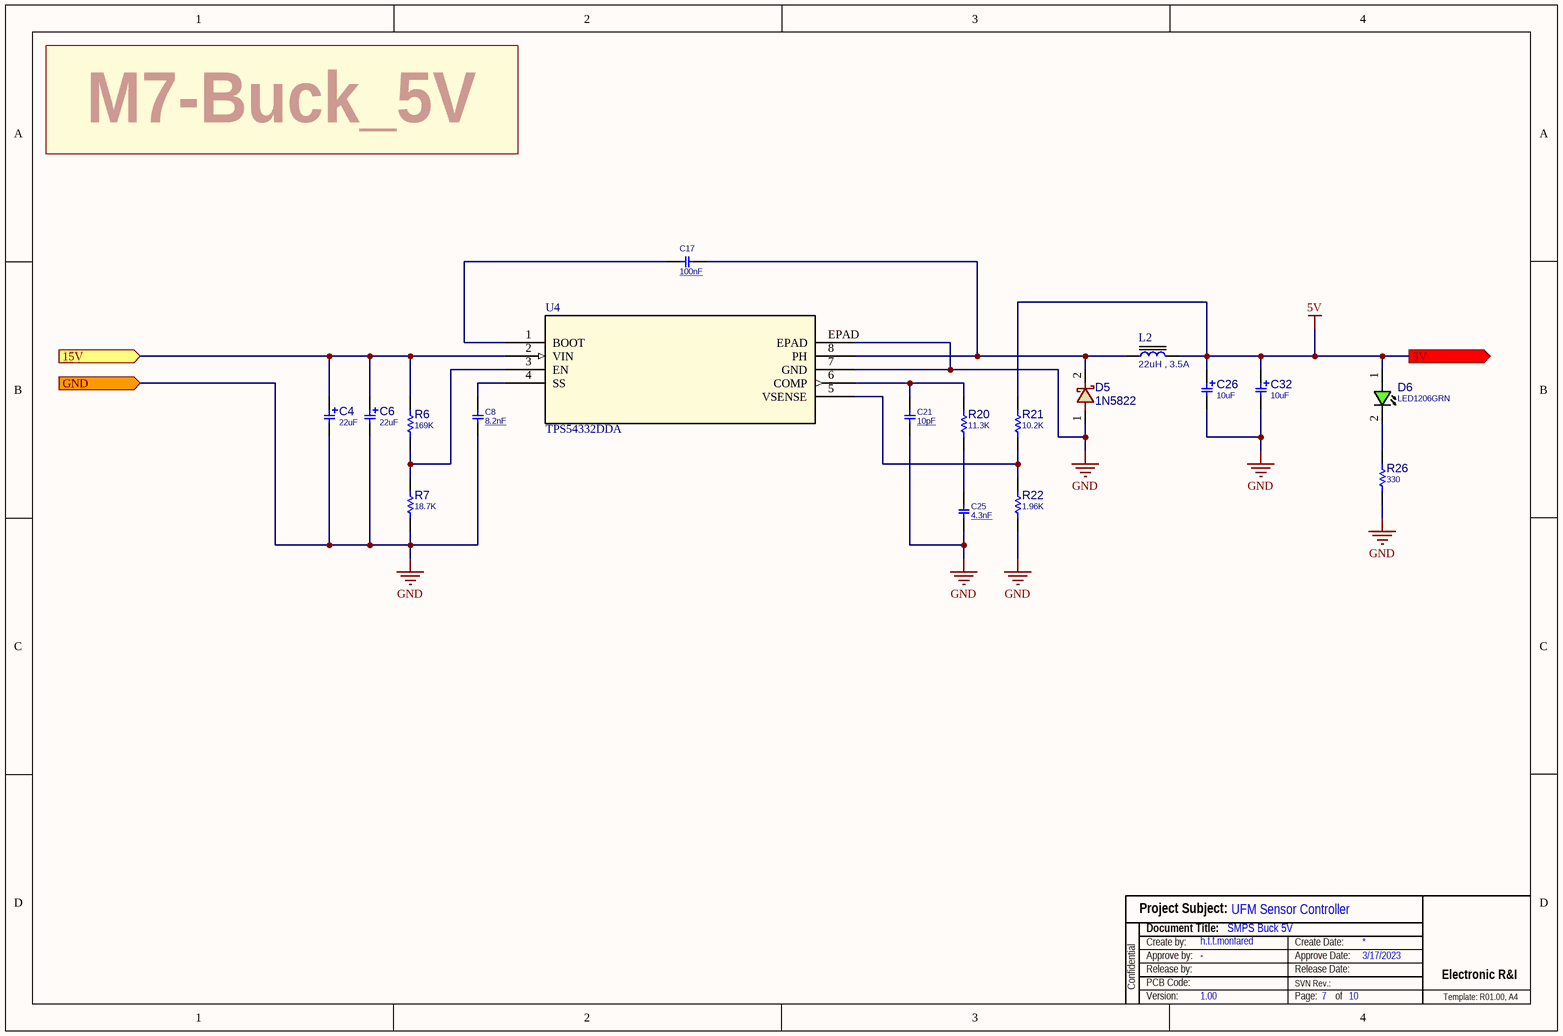
[diagram p3: M7-Buck_5V.SchDoc]

### Parts
C4  22uF  [C1206]
C6  22uF  [C1206]
C8  8.2nF  [C1206]
C17  100nF  [C1206]
C21  10pF  [C1206]
C25  4.3nF  [C1206]
C26  10uF  [C1206]
C32  10uF  [C1206]
D5  1N5822  [D_AX06_DO27]
D6  LED1206GRN  [LED1206GRN]
L2  22uH , 3.5A  [L_12]
R6  169K  [R1206]
R7  18.7K  [R1206]
R20  11.3K  [R1206]
R21  10.2K  [R1206]
R22  1.96K  [R1206]
R26  330  [R1206]
U4  TPS54332DDA  [SO_8T]

### Ports
5V (out), 15V (in), GND (in)

### Nets
5V: C26.1 C32.1 D6.1(ANODE) L2.2 R21.2 ; port 5V
15V: C4.1 C6.1 R6.2 U4.2(VIN) ; port 15V
GND: C4.2 C6.2 C8.1 C21.1 C25.1 C26.2 C32.2 D5.1(A) R7.1 R22.1 R26.1 U4.7(GND) U4.EPAD ; port GND
NetC8_2: C8.2 U4.4(SS)
NetC17_1: C17.1 U4.1(BOOT)
NetC17_2: C17.2 D5.2(K) L2.1 U4.8(PH)
NetC21_2: C21.2 R20.2 U4.6(COMP)
NetC25_2: C25.2 R20.1
NetD6_2: D6.2(CATHODE) R26.2
NetR6_1: R6.1 R7.2 U4.3(EN)
NetR21_1: R21.1 R22.2 U4.5(VSENSE)

### Notes on the sheet
- M7-Buck_5V
- Project Subject:
- Confidential
- Release by:
- Document Title:
- Create by:
- PCB Code:
- Approve by:
- SVN Rev.:
- Create Date:
- Release Date:
- Approve Date:
- Electronic R&I
- Version:
- Page:
- of
- Template: R01.00, A4

### Library data of the parts
C4 C6 C26 C32 = CAP_SMD_EL: as C27 on sheet M6-Buck_15V; PRICE: 10= 5$; MANF: MANF; ASSEMBLY: ASSEMBLY
  C4 C6: VALUE: 22uF
  C26 C32: VALUE: 10uF
C8 C17 C21 C25 = CAP_SMD_MLCC: as C1 on sheet M1-MCU; PARAM: 50V; PRICE: 100= 1$; DESC: CAP, MLCC, 1nF, 50V, C0G, 10%, 0402; PARAM2: C0G, 10%; ASSEMBLY: ASSEMBLY
  C8: VALUE: 8.2nF
  C17: VALUE: 100nF
  C21: VALUE: 10pF
  C25: VALUE: 4.3nF
D5 = DIODE_THD_SCHOTTKY_1N5822: as D3 on sheet M6-Buck_15V; MANF_P#: 1N5822; ASSEMBLY: ASSEMBLY; PRICE: PRICE; PARAM2: 3A; PARAM: 40V; VALUE: 1N5822
D6 = LED_SMD_1206_GRN: as D2 on sheet M1-MCU; MANF: -; ASSEMBLY: ASSEMBLY; PRICE: 36t@Javan; MANF_P#: -; VALUE: LED1206GRN
L2 = IND_THD: INDUCTOR, THD; VALUE: 22uH , 3.5A
R6 R7 R20-R22 R26 = RES_SMD: as R1 on sheet M1-MCU; ASSEMBLY: ASSEMBLY; PRICE: 100= 0.5$
  R6: VALUE: 169K
  R7: VALUE: 18.7K
  R20: VALUE: 11.3K
  R21: VALUE: 10.2K
  R22: VALUE: 1.96K
  R26: VALUE: 330
U4 = TPS54332DDA: as U3 on sheet M6-Buck_15V; Copyright: Copyright (C) 2022 Ultra Librarian. All rights reserved.; Manufacturer_Part_Number: TPS54332DDA; RefDes: RefDes; Type: Type

## Sheet M8-LDO_3.3V.SchDoc
size A4; ApprovedBy: -; CheckedBy: h.t.t.monfared; Author: h.t.t.monfared; Engineer: h.t.t.monfared; Revision: 1.00; SheetNumber: 8; SheetTotal: 10; Project Code:: UFM Sensor Controller; Document Title:: LDO 3.3V; Material Code: 1.00; ReleasedBy: h.t.t.monfared
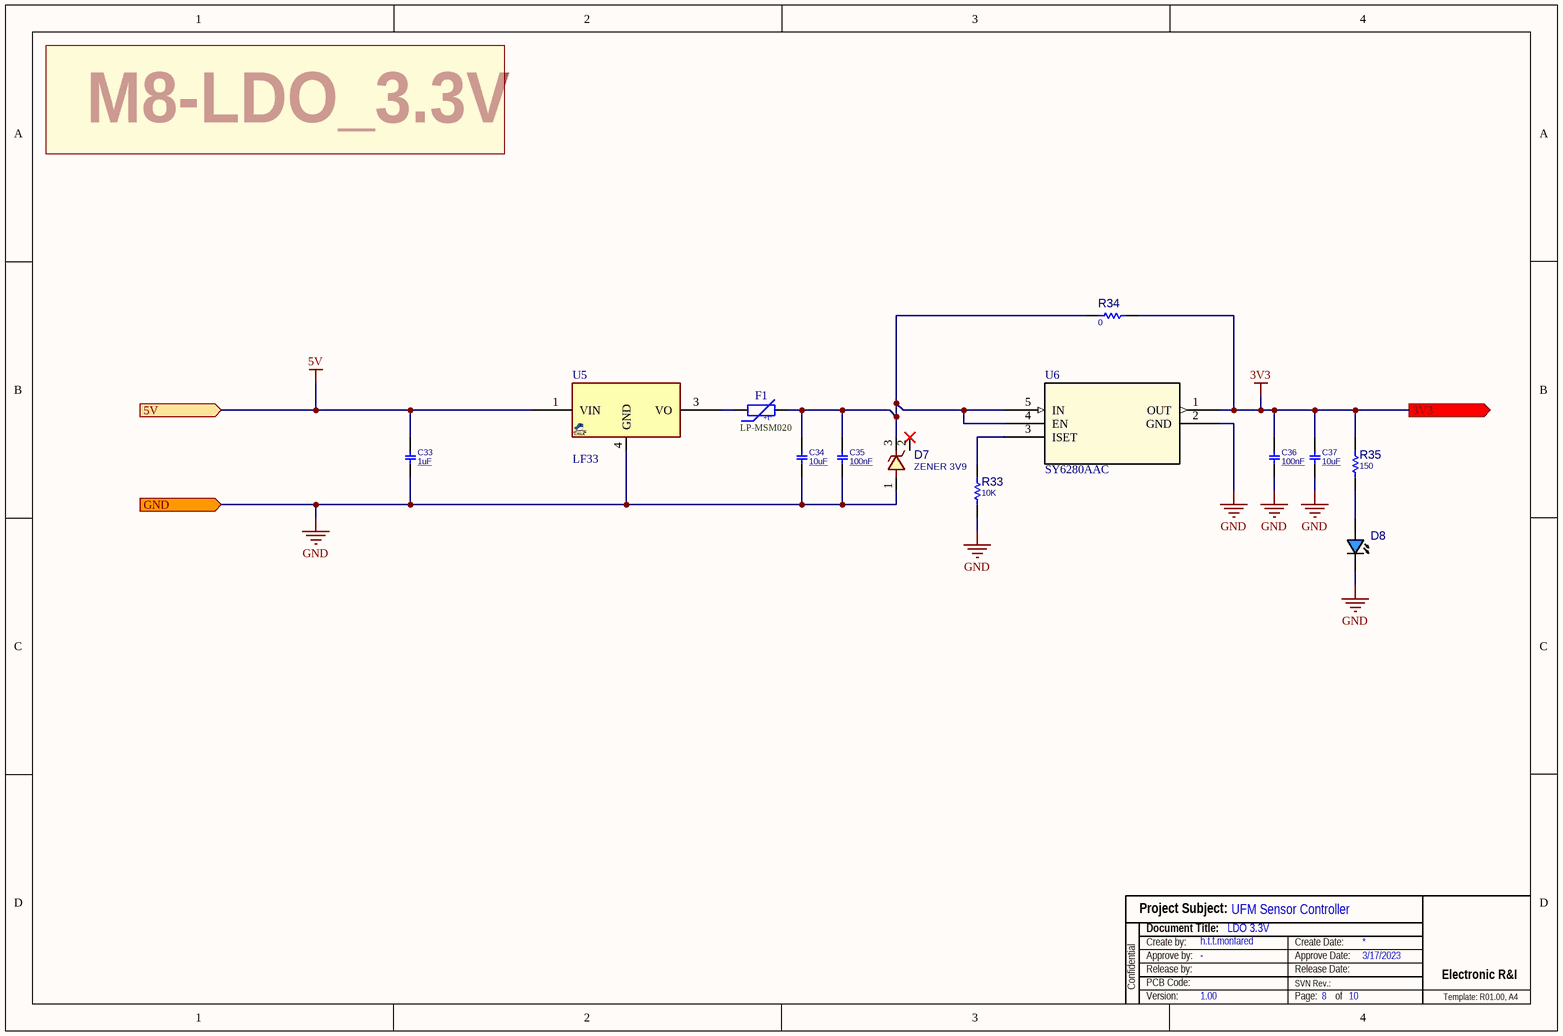
[diagram p4: M8-LDO_3.3V.SchDoc]

### Parts
C33  1uF  [C1206]
C34  10uF  [C1206]
C35  100nF  [C1206]
C36  100nF  [C1206]
C37  10uF  [C1206]
D7  ZENER 3V9  [SOT23_3]
D8  LED1206BLU  [LED1206BLU]  (value not drawn)
F1  LP-MSM020  [F-1812(4532)]
R33  10K  [R1206]
R34  0  [R1206]
R35  150  [R1206]
U5  LF33  [DPAK_3]
U6  SY6280AAC  [SOT23_5]

### Ports
3V3 (out), 5V (in), GND (in)

### Nets
3V3: C36.2 C37.2 R34.2 R35.2 U6.1(OUT) ; port 3V3
5V: C33.2 U5.1(VIN) ; port 5V
GND: C33.1 C34.1 C35.1 C36.1 C37.1 D7.1 D8.2(CATHODE) R33.1 U5.4(GND) U6.2(GND) ; port GND
NetC34_2: C34.2 C35.2 D7.3 F1.2 R34.1 U6.4(EN) U6.5(IN)
NetD8_1: D8.1(ANODE) R35.1
NetF1_1: F1.1 U5.3(VO)
NetR33_2: R33.2 U6.3(ISET)

Not connected (* = marked no-connect by the designer): D7 2*

### Notes on the sheet
- M8-LDO_3.3V
- Project Subject:
- Confidential
- Release by:
- Document Title:
- Create by:
- PCB Code:
- Approve by:
- SVN Rev.:
- Create Date:
- Release Date:
- Approve Date:
- Electronic R&I
- Version:
- Page:
- of
- Template: R01.00, A4
- (in symbol ME05901801) +t°

### Library data of the parts
C33-C37 = CAP_SMD_MLCC: as C1 on sheet M1-MCU; PARAM: C0G, 10%; PRICE: 100= 1$; DESC: CAP, MLCC, 1nF, 50V, C0G, 10%, 0402; PARAM2: 50V; ASSEMBLY: ASSEMBLY
  C33: VALUE: 1uF
  C34 C37: VALUE: 10uF
  C35 C36: VALUE: 100nF
D7 = DIODE_SMD_ZENER_BZX84-C6V2: DIODE, ZENER, 0.25W, 3.9V; MANF: NXP; DESC: DESCRIPTION; PARAM2: 3.9V, 0.9VF; PARAM: 0.25W, 10mA IF; MANF_P#: BZX84-C3V9; ASSEMBLY: ASSEMBLY; PRICE: PRICE; VALUE: ZENER 3V9
D8 = LED_SMD_1206_BLU: LED, SMD, 1206, BLUE; DESC: DESCRIPTION; MANF_P#: MANF_PART#; PARAM2: 2.2V; MANF: MANF; ASSEMBLY: ASSEMBLY; PRICE: 36t@Javan; VALUE: LED1206BLU
F1 = ME05901801: Thermistor,S,PTC,0.2A,1W,1812; Manufacturer 1: CYG; Manufacturer Code1: 0000102083; Manufacturer Name1: Wayon Electronics Co.,Ltd; Unit Price (USD): Coming Soon; Alternative: Please Add; Description Farsi: ترميستور,S,PTC,0.2A,1W,1812; LeadTime: 110; Current-Trip: 0.4A; Designator: RT; Packing: TAPE AND REEL; Temperature-Max Operation: 85°C; Temperature-Min Operation: -40°C; Unit-measurement: PC; Value: 0.6(Ohm); Voltage-Rated: 30V; Material: ME05901801; Function in Circuit: Please Add; Material Class: Thermistor; ComponentLink1Description: DSH2029237RE: Datasheet-CYG; ComponentLink1URL: \\192.168.5.63\eRI_ComponentDatabase\Datasheets\SAP\DSH_2029237_00_1.PDF; Current-Hold: 0.2A; General MPN: LP-MSM020; Lead Free: YES; Manufacturer PN1: LP-MSM020; MPN1: LP-MSM020; Package/Case: 1812; Power: 1W; Termination Style (SMD/THT): SMD; Type: PTC
R33-R35 = RES_SMD: as R76 on sheet MainSheet; MANF_P#: -; MANF: -; ASSEMBLY: ASSEMBLY; PRICE: 100= 0.5$
  R33: VALUE: 10K
  R34: VALUE: 0
  R35: VALUE: 150
U5 = VREG_LFXX_TO252: REG, Linear, LDO0.45V, 0.5A, TO-252; MANF: ST; PARAM2: 1.5/1.8/2.5/3.3/5V; MANF_P#: LF33; PARAM: LDO0.45V, 0.5A; PRICE: 1500t; VALUE: LF33
U6 = SY6280AAC: No Description Available; Mfr_Name: Silergy; Copyright: Copyright (C) 2023 Ultra Librarian. All rights reserved.; Manufacturer_Part_Number: SY6280AAC; RefDes: RefDes; Type: DEV

## Sheet M5-RelayDriver.SchDoc
size A4; ApprovedBy: -; CheckedBy: h.t.t.monfared; Author: h.t.t.monfared; Revision: 1.00; SheetNumber: 5; SheetTotal: 10; Project Code:: UFM Sensor Controller; Document Title:: Output Driver Sheet; Material Code: 1.00; ReleasedBy: h.t.t.monfared
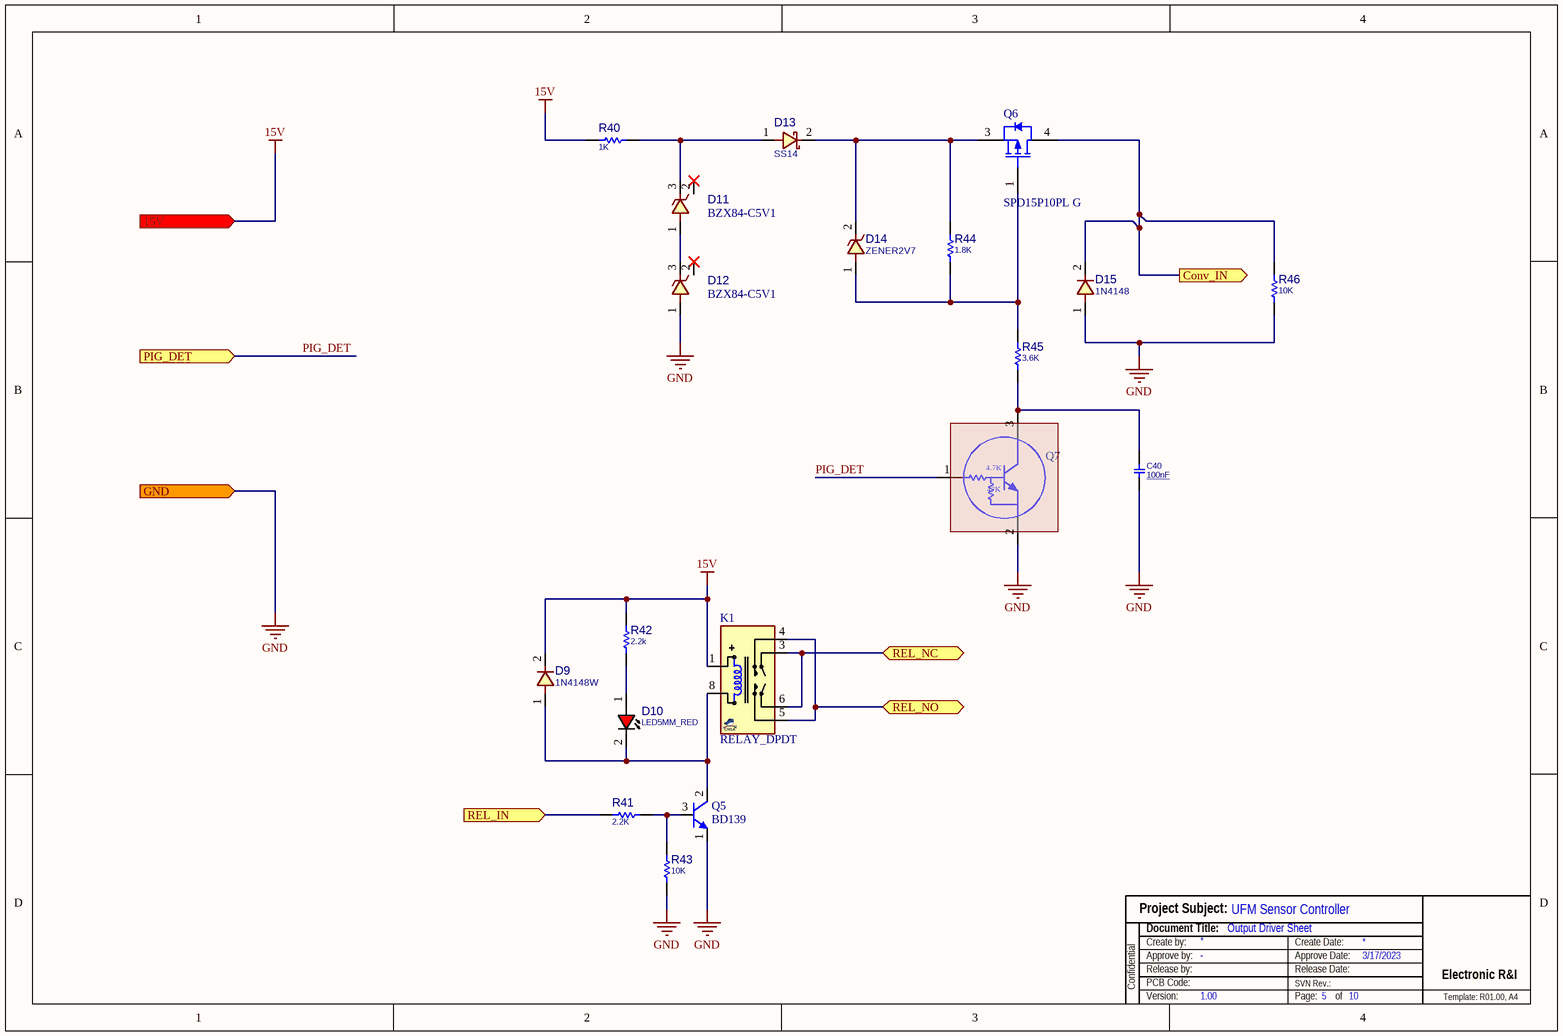
[diagram p5: M5-RelayDriver.SchDoc]

### Parts
C40  100nF  [C1206]
D9  1N4148W  [D_SOD123W]
D10  LED5MM_RED  [LED5MM_RED]
D11  MANF_P#: BZX84-C5V1  [SOT23_3]  (hidden comment: ZENER2V4)
D12  MANF_P#: BZX84-C5V1  [SOT23_3]  (hidden comment: ZENER2V4)
D13  SS14  [D_SMB]
D14  value ZENER2V7  [D0805]  (hidden comment: DIODE_SMD_ZENER_MM3Z2V7B)
D15  1N4148  [D_AX02_DO35]
K1  RELAY_DPDT  [REL_DPDT_8_2913]
Q5  BD139  [TO126_3]
Q6  SPD15P10PL G  [TO-252 (D-PAK)]
Q7  BCR116  [SOT23]  (value not drawn)
R40  1K  [R1206]
R41  2.2K  [R1206]
R42  2.2k  [R1206]
R43  10K  [R1206]
R44  1.8K  [R1206]
R45  3.6K  [R1206]
R46  10K  [R1206]

### Ports
15V (in), Conv_IN (out), GND (in), PIG_DET (in), REL_IN (in), REL_NC (bidir), REL_NO (bidir)

### Nets
15V: D9.2 K1.1(T1) R40.1 R42.2 ; port 15V
GND: C40.1 D12.1 D15.1 Q5.1(E) Q7.2(E) R43.1 R46.1 ; port GND
PIG_DET: Q7.1(B) ; port PIG_DET
NetC40_2: C40.2 Q7.3(C) R45.1
NetD9_1: D9.1 D10.2(CATHODE) K1.8(T2) Q5.2(C)
NetD10_1: D10.1(ANODE) R42.1
NetD11_1: D11.1 D12.3
NetD11_3: D11.3 D13.1 R40.2
NetD13_2: D13.2 D14.2 Q6.3(S) R44.2
NetD14_1: D14.1 Q6.1(G) R44.1 R45.2
NetD15_2: D15.2 Q6.4(D) R46.2 ; port Conv_IN
NetK1_3: K1.3(COM1) K1.6(COM2) ; port REL_NC
NetK1_4: K1.4(NO1) K1.5(NO2) ; port REL_NO
NetQ5_3: Q5.3(B) R41.2 R43.2
NetR41_1: R41.1 ; port REL_IN

Not connected (* = marked no-connect by the designer): D11 2*; D12 2*

### Notes on the sheet
- Project Subject:
- Confidential
- Release by:
- Document Title:
- Create by:
- PCB Code:
- Approve by:
- SVN Rev.:
- Create Date:
- Release Date:
- Approve Date:
- Electronic R&I
- Version:
- Page:
- of
- Template: R01.00, A4
- (in symbol BCR116) 4.7K; 47K

### Library data of the parts
C40 = CAP_SMD_MLCC: as C1 on sheet M1-MCU; PARAM: C0G, 10%; PRICE: 100= 1$; DESC: CAP, MLCC, 1nF, 50V, C0G, 10%, 0402; PARAM2: 50V; ASSEMBLY: ASSEMBLY; VALUE: 100nF
D9 = DIODE_SMD_1N4148_SOD80: DIODE, FAST SWTICHING, 0.3A, 0.5W; DESC: DESCRIPTION; PARAM: 75V; PARAM2: 300mA, 0.5W; MANF_P#: 1N4148; MANF: MANF; ASSEMBLY: ASSEMBLY; PRICE: PRICE; VALUE: 1N4148W
D10 = LED_THD_5MM_RED: LED, THD, 5MM, RED; DESC: DESCRIPTION; MANF_P#: MANF_PART#; PARAM2: 2.2V; MANF: MANF; ASSEMBLY: ASSEMBLY; PRICE: PRICE; VALUE: LED5MM_RED
D11 D12 = DIODE_SMD_ZENER_BZX84-C2V4: DIODE, ZENER, 0.25W, 2.4V; MANF: NXP; DESC: DESCRIPTION; PARAM2: 5.1V, 0.9VF; PARAM: 0.25W, 10mA IF; ASSEMBLY: ASSEMBLY; PRICE: PRICE; VALUE: ZENER2V4
D13 = DIODE_SMD_SCHOTTKY_SS14: DIODE, SCHOTTKY, 40V, 1A; MANF: Vishay; DESC: DESCRIPTION; MANF_P#: SS14-E3; ASSEMBLY: ASSEMBLY; PRICE: PRICE; PARAM2: 1A; PARAM: 40V; VALUE: SS14
D14 = DIODE_SMD_ZENER_MM3Z2V7B: DIODE, ZENER, 0.2W, 2.7V; MANF: Fairchild; DESC: DESCRIPTION; PRICE: 0.036; MANF_P#: MM3Z2V7B; ASSEMBLY: ASSEMBLY; PARAM2: 0.2W; PARAM: 2.7V
D15 = DIODE_THD_1N4148_DO35: as D1 on sheet M1-MCU; MANF: MANF; ASSEMBLY: ASSEMBLY; PRICE: PRICE; MANF_P#: 1N4148; VALUE: 1N4148
K1 = RELAY_DPST_8_2913_RT2: Relay, DPDT, 8P, 29X13mm, RT2, 400VAC/8A; MANF: TE; MANF_P#: RTE24012; PARAM2: 8A, 400VAC; PARAM: 12V, 30mA, 360Ohm; PRICE: 3$; Value: RELAY_DPDT
Q5 = NPN_BD139_TO126: BJT, NPN, 80V, 1.5A; MANF: FAIRCHILD; VALUE: BD139; MANF_P#: BD139
Q6 = ME11031101: Transistor-MOSFET,S,P,15A,100V,TO-252; Manufacturer Code1: 0000101173; Manufacturer Name1: Infineon; Unit Price (USD): Coming Soon; Function in Circuit: Please Add; Material Class: Transistor-FET; Description Farsi: ترانزيستور-ماسفت,S,P,15A,100V,TO-252; Voltage-Breakdown Drain Source: -100V; Type: MOSFET; Automotive Qualified: AEC-Q101; Polarity-N/P: P-CHANNEL; Temperature-Min Operation: -55°C; Packing: TAPE AND REEL; AltCode-1: ALTE594:ACTIVE; Thermal Resistance-RJA: 75(°K/W); Temperature-Max Operation: 175°C; AltMat-1: ME11028601; Number of Unit: 1; Resistance-ON (Ron): 200(mOhm); Current-Max Pulsed Drain: -60A; Power: 128W; Capacitance-Input: 1.49nF; Voltage-Max Gate Source: ±20V; AltMat-2: ME11031301; Current-Max Drain: -15A; Voltage-Threshold Gate: -1V; Material: ME11031101; ComponentLink5Description: DSH2053301RE: TDT_PowerMOSFET; Lead Free: YES; ComponentLink4Description: DSH2066440RE: TDT_Infineon; ComponentLink5URL: \\192.168.5.63\eRI_ComponentDatabase\Datasheets\SAP\DSH_2053301_00_1.PDF; ComponentLink1URL: \\192.168.5.63\eRI_ComponentDatabase\Datasheets\SAP\DSH_2045621_00_1.PDF; Package/Case: TO-252 (DPAK); ComponentLink3URL: \\192.168.5.63\eRI_ComponentDatabase\Datasheets\SAP\DSH_2084696_00_1.PDF; ComponentLink2Description: DSH2045618RE: Application Note-ON; Halogen Free: NOT MENTIONED; Temperature-Min Storage: -55°C; ComponentLink3Description: DSH2084696RE: DSH-PKG_Infineon; ComponentLink6URL: \\192.168.5.63\eRI_ComponentDatabase\Datasheets\SAP\DSH_2065146_00_1.PDF; Termination Style (SMD/THT): SMD; Manufacturer PN1: SPD15P10PL G; ComponentLink6Description: DSH2065146RE: TDT_TOSHIBA; ComponentLink2URL: \\192.168.5.63\eRI_ComponentDatabase\Datasheets\SAP\DSH_2045618_00_1.PDF; Voltage-Max Drain Source: -100V; ComponentLink4URL: \\192.168.5.63\eRI_ComponentDatabase\Datasheets\SAP\DSH_2066440_00_1.PDF; ComponentLink1Description: DSH2045621RE: Application Note-ON; Temperature-Max Storage: 175°C; RoHS: YES; Size (LxWxH)/(DxH): NA
Q7 = BCR116: NPN Silicon Digital Transistor
R40 R43 R46 = RES_SMD: as R76 on sheet MainSheet; MANF_P#: -; MANF: -; ASSEMBLY: ASSEMBLY; PRICE: 100= 0.5$
  R40: VALUE: 1K
  R43 R46: VALUE: 10K
R41 = RES_SMD: as R5 on sheet M1-MCU; ASSEMBLY: ASSEMBLY; PRICE: 100= 0.5$; VALUE: 2.2K
R42 = RES_SMD: as R1 on sheet M1-MCU; ASSEMBLY: ASSEMBLY; PRICE: 100= 0.5$; VALUE: 2.2k
R44 R45 = RES_SMD_1206: RESISTOR, SMD; PARAM: -W; DESC: DESCRIPTION; DIST#: MOUSER; PARAM2: 1%; MANF_P#: -; MANF: -; ASSEMBLY: ASSEMBLY; PRICE: 100= 0.5$
  R44: VALUE: 1.8K
  R45: VALUE: 3.6K

## Sheet M3-LCD.SchDoc
size A4; ApprovedBy: -; CheckedBy: h.t.t.monfared; Author: h.t.t.monfared; Engineer: h.t.t.monfared; DocumentNumber: 1; Revision: 1.00; SheetNumber: 3; SheetTotal: 10; Project Code:: UFM Sensor Controller; Document Title:: OLED Sheet; Material Code: 1.00; ReleasedBy: h.t.t.monfared
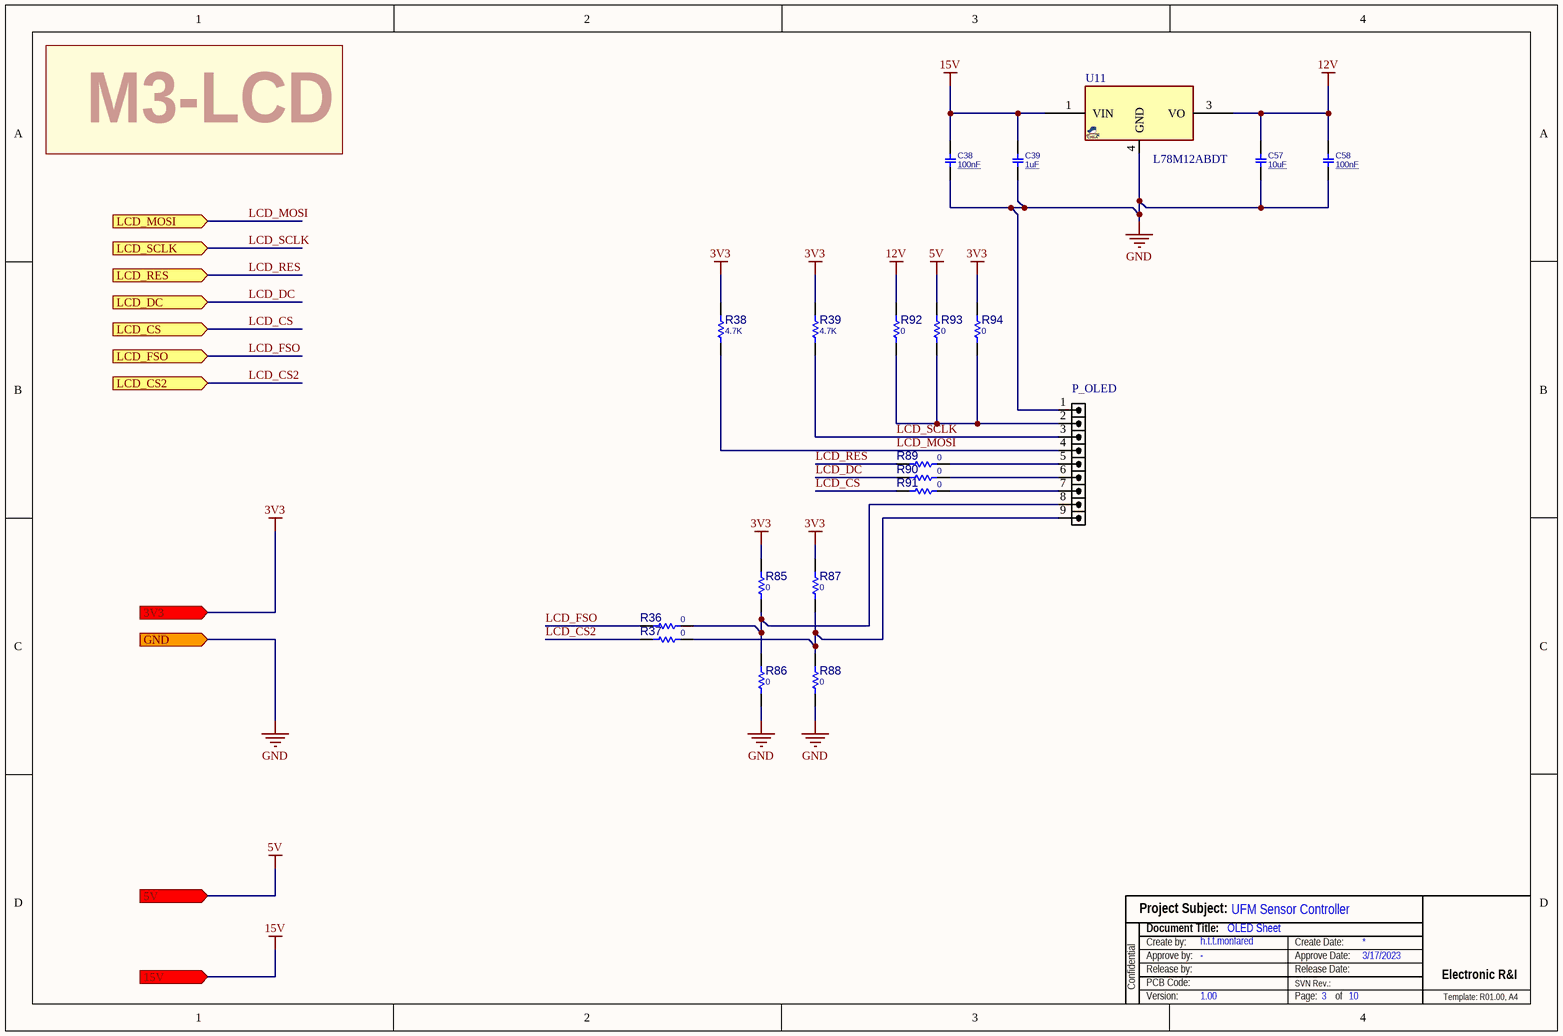
[diagram p6: M3-LCD.SchDoc]

### Parts
C38  100nF  [C1206]
C39  1uF  [C1206]
C57  10uF  [C1206]
C58  100nF  [C1206]
P_OLED  HDR1X9  [TMS9]  (value not drawn)
R36  0  [R1206]
R37  0  [R1206]
R38  4.7K  [R1206]
R39  4.7K  [R1206]
R85  0  [R1206]
R86  0  [R1206]
R87  0  [R1206]
R88  0  [R1206]
R89  0  [R1206]
R90  0  [R1206]
R91  0  [R1206]
R92  0  [R1206]
R93  0  [R1206]
R94  0  [R1206]
U11  L78M12ABDT  [DPAK_3]

### Ports
3V3 (in), 5V (in), 15V (in), GND (in), LCD_CS2 (in), LCD_CS (in), LCD_DC (in), LCD_FSO (in), LCD_MOSI (in), LCD_RES (in), LCD_SCLK (in)

### Nets
3V3: R38.1 R39.1 R85.2 R87.2 R94.2 ; port 3V3
5V: R93.2 ; port 5V
12V: C57.2 C58.2 R92.2 U11.3(VO)
15V: C38.2 C39.2 U11.1(VIN) ; port 15V
GND: C38.1 C39.1 C57.1 C58.1 P_OLED.1 R86.1 R88.1 U11.4(GND) ; port GND
LCD_CS: R91.1 ; port LCD_CS
LCD_CS2: R37.2 ; port LCD_CS2
LCD_DC: R90.1 ; port LCD_DC
LCD_FSO: R36.2 ; port LCD_FSO
LCD_MOSI: P_OLED.4 R38.2 ; port LCD_MOSI
LCD_RES: R89.1 ; port LCD_RES
LCD_SCLK: P_OLED.3 R39.2 ; port LCD_SCLK
NetP_OLED_2: P_OLED.2 R92.1 R93.1 R94.1
NetP_OLED_5: P_OLED.5 R89.2
NetP_OLED_6: P_OLED.6 R90.2
NetP_OLED_7: P_OLED.7 R91.2
NetP_OLED_8: P_OLED.8 R36.1 R85.1 R86.2
NetP_OLED_9: P_OLED.9 R37.1 R87.1 R88.2

### Notes on the sheet
- M3-LCD
- Project Subject:
- Confidential
- Release by:
- Document Title:
- Create by:
- PCB Code:
- Approve by:
- SVN Rev.:
- Create Date:
- Release Date:
- Approve Date:
- Electronic R&I
- Version:
- Page:
- of
- Template: R01.00, A4

### Library data of the parts
C38 C39 C57 C58 = CAP_SMD_MLCC: as C1 on sheet M1-MCU; PARAM: C0G, 10%; PRICE: 100= 1$; DESC: CAP, MLCC, 1nF, 50V, C0G, 10%, 0402; PARAM2: 50V; ASSEMBLY: ASSEMBLY
  C38 C58: VALUE: 100nF
  C39: VALUE: 1uF
  C57: VALUE: 10uF
P_OLED = HDR_M_1X9: CONN, HEADER, Male, pitch: 2.54mm, 9POS; VALUE: HDRM9
R36-R39 R85-R94 = RES_SMD: as R76 on sheet MainSheet; MANF_P#: -; MANF: -; ASSEMBLY: ASSEMBLY; PRICE: 100= 0.5$
  R36 R37 R85-R94: VALUE: 0
  R38 R39: VALUE: 4.7K
U11 = VREG_78M12_TO252: REG, Linear, Fixed, 12v, 0.5A, TO-252; MANF_P#: MC78M12CDT, UA78M12CKV, MC78M12ABDT, L78M12CDT, MC78M12BDT, BA78M12FP, TS78M12CP; MANF: TI, ST, ON, ROHM, TS; PARAM: 12v, 0.5A; PARAM2: PARAM2; VALUE: L78M12ABDT

## Sheet M2-RS485.SchDoc
size A4; ApprovedBy: -; CheckedBy: h.t.t.monfared; Author: h.t.t.monfared; Engineer: h.t.t.monfared; DocumentNumber: 1; Revision: 1.00; SheetNumber: 2; SheetTotal: 10; Project Code:: UFM Sensor Controller; Document Title:: RS485 Sheet; Material Code: 1.00; ReleasedBy: h.t.t.monfared
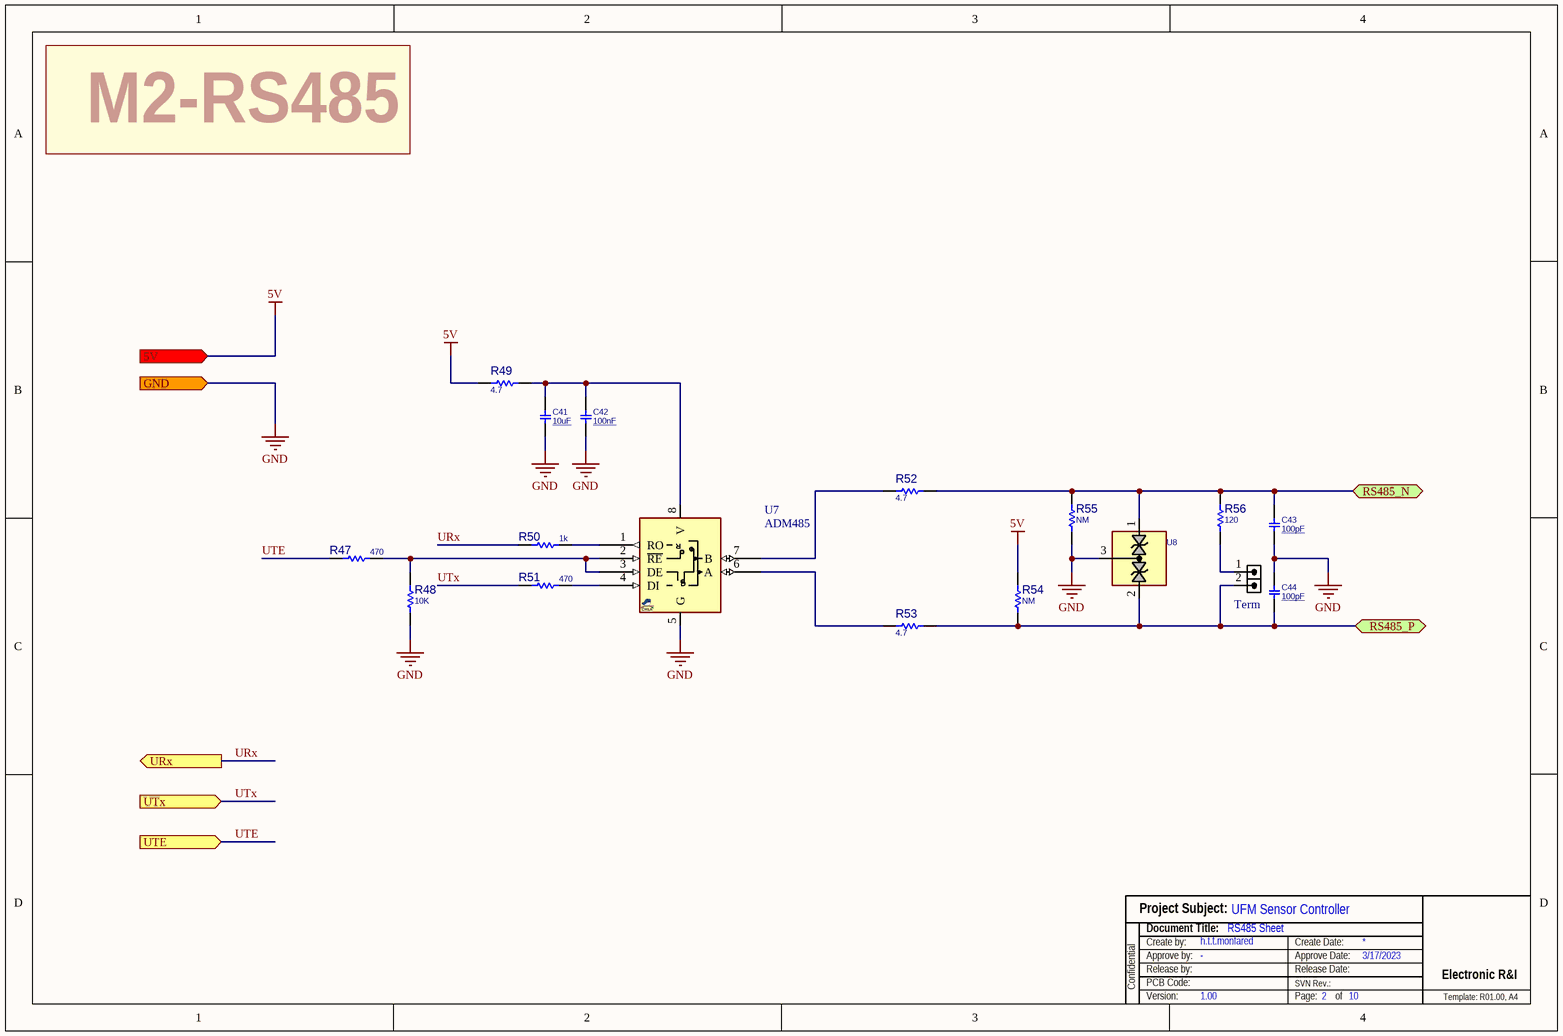
[diagram p7: M2-RS485.SchDoc]

### Parts
C41  10uF  [C1206]
C42  100nF  [C1206]
C43  100pF  [C1206]
C44  100pF  [C1206]
R47  470  [R1206]
R48  10K  [R1206]
R49  4.7  [R1206]
R50  1k  [R1206]
R51  470  [R1206]
R52  4.7  [R1206]
R53  4.7  [R1206]
R54  NM  [R1206]
R55  NM  [R1206]
R56  120  [R1206]
Term  HDRM2  [HDR_M_1X2]  (value not drawn)
U7  ADM485  [SO_8]
U8  CDSOT23-SM712  [SOT23_3]  (value not drawn)

### Ports
5V (in), GND (in), RS485_N (bidir), RS485_P (bidir), URx (out), UTE (in), UTx (in)

### Nets
5V: R49.2 R54.2 ; port 5V
GND: C41.1 C42.1 C43.1 C44.2 R48.1 R55.1 U7.5(G) U8.3(NC) ; port GND
URx: R50.1 ; port URx
UTE: R47.1 ; port UTE
UTx: R51.1 ; port UTx
NetC41_2: C41.2 C42.2 R49.1 U7.8(V)
NetC43_2: C43.2 R52.2 R55.2 R56.2 U8.1(NC) ; port RS485_N
NetC44_1: C44.1 R53.2 R54.1 Term.2 U8.2(GND) ; port RS485_P
NetR47_2: R47.2 R48.2 U7.2(~{RE}) U7.3(DE)
NetR50_2: R50.2 U7.1(RO)
NetR51_2: R51.2 U7.4(DI)
NetR52_1: R52.1 U7.7(B)
NetR53_1: R53.1 U7.6(A)
NetR56_1: R56.1 Term.1

### Notes on the sheet
- M2-RS485
- Project Subject:
- Confidential
- Release by:
- Document Title:
- Create by:
- PCB Code:
- Approve by:
- SVN Rev.:
- Create Date:
- Release Date:
- Approve Date:
- Electronic R&I
- Version:
- Page:
- of
- Template: R01.00, A4
- (in symbol ADM485_SOP8) R; D

### Library data of the parts
C41-C44 = CAP_SMD_MLCC: as C1 on sheet M1-MCU; PARAM: C0G, 10%; PRICE: 100= 1$; DESC: CAP, MLCC, 1nF, 50V, C0G, 10%, 0402; PARAM2: 50V; ASSEMBLY: ASSEMBLY
  C41: VALUE: 10uF
  C42: VALUE: 100nF
  C43 C44: VALUE: 100pF
R47-R56 = RES_SMD: as R76 on sheet MainSheet; MANF_P#: -; MANF: -; ASSEMBLY: ASSEMBLY; PRICE: 100= 0.5$
  R47 R51: VALUE: 470
  R48: VALUE: 10K
  R49 R52 R53: VALUE: 4.7
  R50: VALUE: 1k
  R54 R55: VALUE: NM
  R56: VALUE: 120
Term = HDR_M_1X2: CONN, HEADER, Male, pitch: 2.54mm, 2POS; VALUE: HDRM2
U7 = ADM485_SOP8: RS-485 Transceiver, 5V, SOP-8, ±7V Ground Difference Between Devices on the Bus; MANF_P#: ADM485AR; MANF: Analog Devices; PRICE: 4000toman@PAYA; VALUE: ADM485
U8 = TVS_X2_CDSOT23-SM712: TVS, ESD PROTECT, 2CH, 400W/17A PP, 7.5VBR, ±8KV ESDmin; MANF: Bourns; PARAM: 400W/17A peak-pulse; MANF_P#: CDSOT23-SM712; PARAM2: 7.5VBR, ±8KV ESD min; PRICE: 1.6$; VALUE: CDSOT23-SM712

## Sheet M4-Comprator.SchDoc
size A4; ApprovedBy: -; CheckedBy: h.t.t.monfared; Author: h.t.t.monfared; Revision: 1.00; SheetNumber: 4; SheetTotal: 10; Project Code:: UFM Sensor Controller; Document Title:: Comperator Sheet; Material Code: 1.00; ReleasedBy: h.t.t.monfared
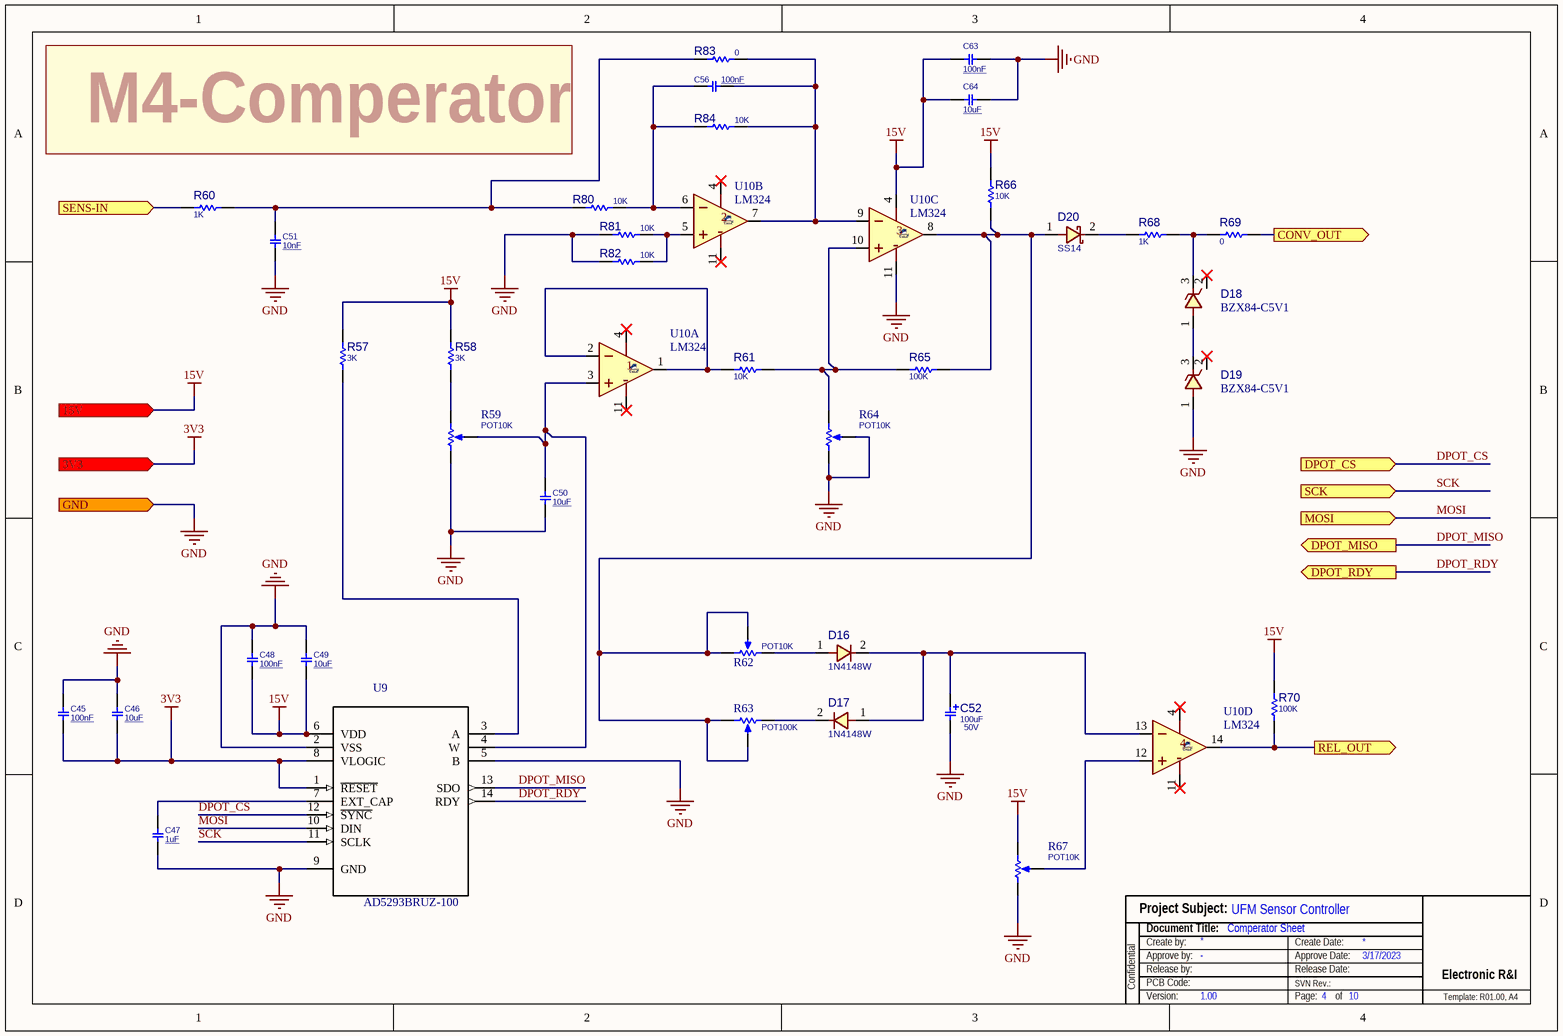
[diagram p8: M4-Comprator.SchDoc]

### Parts
C45  100nF  [C1206]
C46  10uF  [C1206]
C47  1uF  [C1206]
C48  100nF  [C1206]
C49  10uF  [C1206]
C50  10uF  [C1206]
C51  10nF  [C1206]
C52  PARAM2: 50V  [C_EL_8]  (hidden comment: 100uF)
C56  100nF  [C1206]
C63  100nF  [C1206]
C64  10uF  [C1206]
D16  1N4148W  [D_SOD123W]
D17  1N4148W  [D_SOD123W]
D18  MANF_P#: BZX84-C5V1  [SOT23_3]  (hidden comment: ZENER2V4)
D19  MANF_P#: BZX84-C5V1  [SOT23_3]  (hidden comment: ZENER2V4)
D20  SS14  [D_SMB]
R57  3K  [R1206]
R58  3K  [R1206]
R59  POT10K  [POT_3296W]
R60  1K  [R1206]
R61  10K  [R1206]
R62  POT10K  [POT_3296W]
R63  POT100K  [POT_3296W]
R64  POT10K  [POT_3296W]
R65  100K  [R1206]
R66  10K  [R1206]
R67  POT10K  [POT_3296W]
R68  1K  [R1206]
R69  0  [R1206]
R70  100K  [R1206]
R80  10K  [R1206]
R81  10K  [R1206]
R82  10K  [R1206]
R83  0  [R1206]
R84  10K  [R1206]
U9  AD5293BRUZ-100  [RU_14_ADI]
U10  LM324  [SO_14]  (parts A,B,C,D of 4)

### Ports
3V3 (in), 15V (in), CONV_OUT (out), DPOT_CS (in), DPOT_MISO (out), DPOT_RDY (out), GND (in), MOSI (in), REL_OUT (out), SCK (in), SENS-IN (in)

### Nets
3V3: C45.1 C46.1 U9.1(~{RESET}) U9.8(VLOGIC) ; port 3V3
15V: C48.1 C49.1 C63.1 C64.1 R57.2 R58.2 R66.2 R67.3(BOT) R70.2 U9.6(VDD) U10.4(V+) ; port 15V
GND: C45.2 C46.2 C47.1 C48.2 C49.2 C50.1 C51.1 C52.2 C63.2 C64.2 D19.1 R59.1(TOP) R64.1(TOP) R64.2(TAP) R67.1(TOP) R81.1 R82.1 U9.2(VSS) U9.5(B) U9.9(GND) U10.11(V-) ; port GND
DPOT_CS: U9.12(~{SYNC}) ; port DPOT_CS
DPOT_MISO: U9.13(SDO) ; port DPOT_MISO
DPOT_RDY: U9.14(RDY) ; port DPOT_RDY
MOSI: U9.10(DIN) ; port MOSI
SCK: U9.11(SCLK) ; port SCK
NetC47_2: C47.2 U9.7(EXT_CAP)
NetC50_2: C50.2 R59.2(TAP) U9.4(W) U10.3(IN+)
NetC51_2: C51.2 R60.2 R80.1 R83.1
NetC52_1: C52.1 D16.2 D17.1 U10.13(IN-)
NetC56_1: C56.1 R80.2 R84.1 U10.6(IN-)
NetC56_2: C56.2 R83.2 R84.2 U10.7(OUT) U10.9(IN-)
NetD16_1: D16.1 R62.1(TOP)
NetD17_2: D17.2 R63.3(BOT)
NetD18_1: D18.1 D19.3
NetD18_3: D18.3 R68.2 R69.1
NetD20_1: D20.1 R62.2(TAP) R62.3(BOT) R63.1(TOP) R63.2(TAP) R65.2 R66.1 U10.8(OUT)
NetD20_2: D20.2 R68.1
NetR9_1: R60.1 ; port SENS-IN
NetR57_1: R57.1 U9.3(A)
NetR58_1: R58.1 R59.3(BOT)
NetR61_1: R61.1 U10.1(OUT) U10.2(IN-)
NetR61_2: R61.2 R64.3(BOT) R65.1 U10.10(IN+)
NetR67_2: R67.2(TAP) U10.12(IN+)
NetR69_2: R69.2 ; port CONV_OUT
NetR70_1: R70.1 U10.14(OUT) ; port REL_OUT
NetR81_2: R81.2 R82.2 U10.5(IN+)

Not connected (* = marked no-connect by the designer): D18 2*; D19 2*

### Notes on the sheet
- M4-Comperator
- Project Subject:
- Confidential
- Release by:
- Document Title:
- Create by:
- PCB Code:
- Approve by:
- SVN Rev.:
- Create Date:
- Release Date:
- Approve Date:
- Electronic R&I
- Version:
- Page:
- of
- Template: R01.00, A4

### Library data of the parts
C45-C51 C56 C63 C64 = CAP_SMD_MLCC: as C1 on sheet M1-MCU; PARAM: C0G, 10%; PRICE: 100= 1$; DESC: CAP, MLCC, 1nF, 50V, C0G, 10%, 0402; PARAM2: 50V; ASSEMBLY: ASSEMBLY
  C45 C48 C56 C63: VALUE: 100nF
  C46 C49 C50 C64: VALUE: 10uF
  C47: VALUE: 1uF
  C51: VALUE: 10nF
C52 = CAP_SMD_EL: CAP, THD, ELEC,; MANF_P#: MANF_PART#; DESC: DESCRIPTION; DIST#: MOUSER; PARAM: 20%; PRICE: 10= -$; MANF: MANF; ASSEMBLY: ASSEMBLY; VALUE: 100uF
D16 D17 = DIODE_SMD_1N4148_SOD80: as D9 on sheet M5-RelayDriver; MANF: MANF; ASSEMBLY: ASSEMBLY; PRICE: PRICE; VALUE: 1N4148W
D18 D19 = DIODE_SMD_ZENER_BZX84-C2V4: as D11 on sheet M5-RelayDriver; ASSEMBLY: ASSEMBLY; PRICE: PRICE; VALUE: ZENER2V4
D20 = DIODE_SMD_SCHOTTKY_SS14: as D13 on sheet M5-RelayDriver; ASSEMBLY: ASSEMBLY; PRICE: PRICE; PARAM2: 1A; PARAM: 40V; VALUE: SS14
R57 R58 R60 R61 R65 R66 R68-R70 R80-R84 = RES_SMD: as R76 on sheet MainSheet; MANF_P#: -; MANF: -; ASSEMBLY: ASSEMBLY; PRICE: 100= 0.5$
  R57 R58: VALUE: 3K
  R60 R68: VALUE: 1K
  R61 R66 R80-R82 R84: VALUE: 10K
  R65 R70: VALUE: 100K
  R69 R83: VALUE: 0
R59 R62-R64 R67 = RES_THD_POT_3296W: RESISTOR, THD, Potentiometer
  R59 R62 R64 R67: VALUE: POT10K
  R63: VALUE: POT100K
U9 = AD5293BRUZ-100: Digital Potentiometer 100k Ohm 1 Circuit 1024 Taps SPI Interface 14-TSSOP; MF: Analog Devices; Price: None; Availability: Unavailable; SnapEDA_Link: https://www.snapeda.com/parts/AD5293BRUZ-100/Analog%20Devices%20Inc./view-part/385281/?ref=snap; Package: TSSOP-14 Analog Devices; MP: AD5293BRUZ-100; Value: *
U10 = LM324_SOP14: AMP, Quad, Single-Supply; MANF: ON, Texas Instruments, ST; MANF_P#: LM324AD; VALUE: LM324

## Sheet M9-PowerMeas.SchDoc
size A4; ApprovedBy: -; CheckedBy: h.t.t.monfared; Author: h.t.t.monfared; Engineer: h.t.t.monfared; Revision: 1.0; SheetNumber: 9; SheetTotal: 10; Project Code:: UFM Sensor Controller; Document Title:: Power Measurement Sheet; Material Code: 1.00; ReleasedBy: h.t.t.monfared
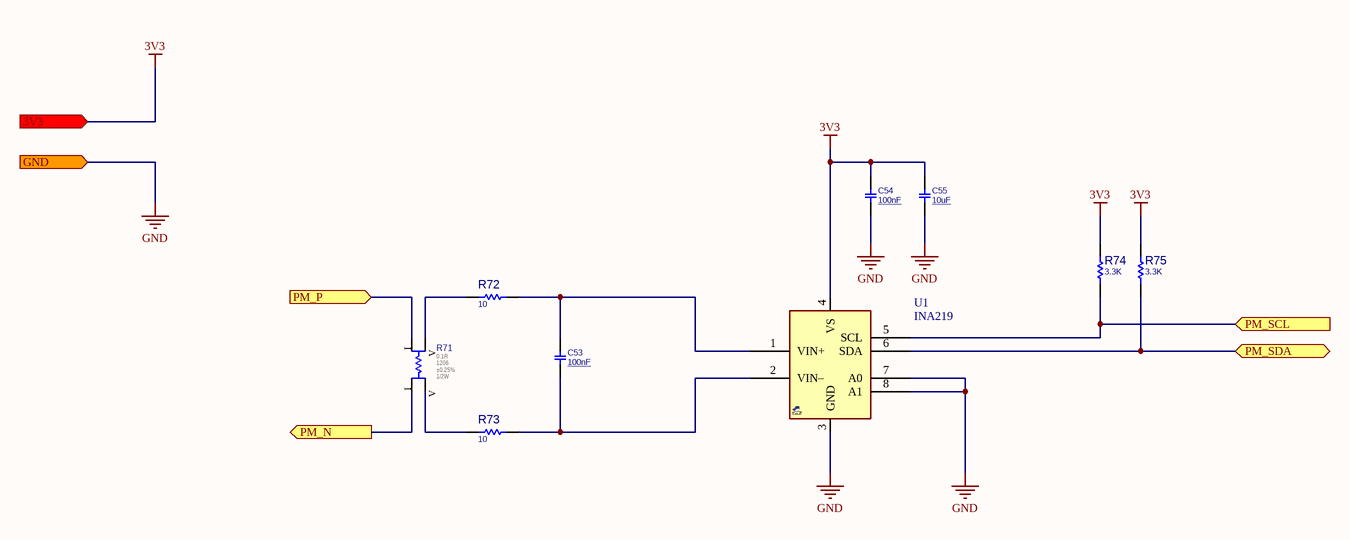
[diagram p9: M9-PowerMeas.SchDoc]

### Parts
C53  100nF  [C1206]
C54  100nF  [C1206]
C55  10uF  [C1206]
R71  0.1R  Package/Case: 1206  Tolerance: ±0.25%  Power: 1/2W  [R-1206_LVK]
R72  10  [R1206]
R73  10  [R1206]
R74  3.3K  [R1206]
R75  3.3K  [R1206]
U1  INA219  [SOT23_8]

### Ports
3V3 (in), GND (in), PM_N (out), PM_P (in), PM_SCL (in), PM_SDA (bidir)

### Nets
3V3: C54.2 C55.2 R74.2 R75.2 U1.4(VS) ; port 3V3
GND: C54.1 C55.1 U1.3(GND) U1.7(A0) U1.8(A1) ; port GND
PM_SCL: R74.1 U1.5(SCL) ; port PM_SCL
PM_SDA: R75.1 U1.6(SDA) ; port PM_SDA
NetC53_1: C53.1 R73.1 U1.2(VIN–)
NetC53_2: C53.2 R72.1 U1.1(VIN+)
NetPowerMeas_IN_1: R71.2(I) ; port PM_N
NetPowerMeas_IN_2: R71.4(I) ; port PM_P
NetR71_1: R71.1(V) R73.2
NetR71_3: R71.3(V) R72.2

### Notes on the sheet
- Project Subject:
- Confidential
- Release by:
- Document Title:
- Create by:
- PCB Code:
- Approve by:
- SVN Rev.:
- Create Date:
- Release Date:
- Approve Date:
- Electronic R&I
- Version:
- Page:
- of
- Template: R01.00, A4

### Library data of the parts
C53-C55 = CAP_SMD_MLCC: as C1 on sheet M1-MCU; PARAM: C0G, 10%; PRICE: 100= 1$; DESC: CAP, MLCC, 1nF, 50V, C0G, 10%, 0402; PARAM2: 50V; ASSEMBLY: ASSEMBLY
  C53 C54: VALUE: 100nF
  C55: VALUE: 10uF
R71 = ME05186701: Resistor,S,TF,0.1R,1/2W,0.25%,1206; Manufacturer Code1: 0000103772; Manufacturer Name1: Ohmite Co.; Manufacturer PN1: LVK12R100CER; Unit Price (USD): Coming Soon; Alternative: Please Add; Description Farsi: S,TF,0.1R,1/2W,0.25%,1206,مقاومت; Temperature-Max Operation (TJ): 125℃; Automotive Qualified: Non-Automotive; Packing: TAPE AND REEL; Temperature-Min Operation (TJ): -40℃; Torque-Nominal: Not Applicable; Number of Unit: 1; Designator: R; Voltage-Max Overload: 1.41V; TCR1: ±50; Current-Rated: 20A; Voltage-Max RCWV: 0.224V; Material: ME05186701; Function in Circuit: Please Add; Material Class: Resistor; Type: Chip; Lead Free: YES; ComponentLink1URL: \\192.168.5.63\eRI_ComponentDatabase\Datasheets\SAP\DSH_2024957_00_1.PDF; ComponentLink3URL: \\192.168.5.63\eRI_ComponentDatabase\Datasheets\SAP\DSH_2084726_00_1.PDF; ComponentLink2Description: DSH2027350RE: Application Note-Vishay; Halogen Free: NO; ComponentLink3Description: DSH2084726RE: DSH-PKG-PDT_Ohmite; Termination Style (SMD/THT): SMD; Value: 0.1R; ComponentLink2URL: \\192.168.5.63\eRI_ComponentDatabase\Datasheets\SAP\DSH_2027350_00_1.PDF; ComponentLink1Description: DSH2024957RE: Application Note-Vishay; RoHS: YES; ComponentLink9Description: How to Select
R72-R75 = RES_SMD: as R76 on sheet MainSheet; MANF_P#: -; MANF: -; ASSEMBLY: ASSEMBLY; PRICE: 100= 0.5$
  R72 R73: VALUE: 10
  R74 R75: VALUE: 3.3K
U1 = INA219_SOT23: Current/Power Monitor, Zerø-Drift, Bidirectional, I2C; MANF: TEXAS INSTRUMENTS; MANF_P#: INA219AIDCN, INA219BIDCN; PARAM2: 3~5.5VCC; PARAM: 0~26V, 0.5%, -40~125°C; VALUE: INA219